# Altium project M.2 Accelerator.PrjPcb (part 1 of 2)
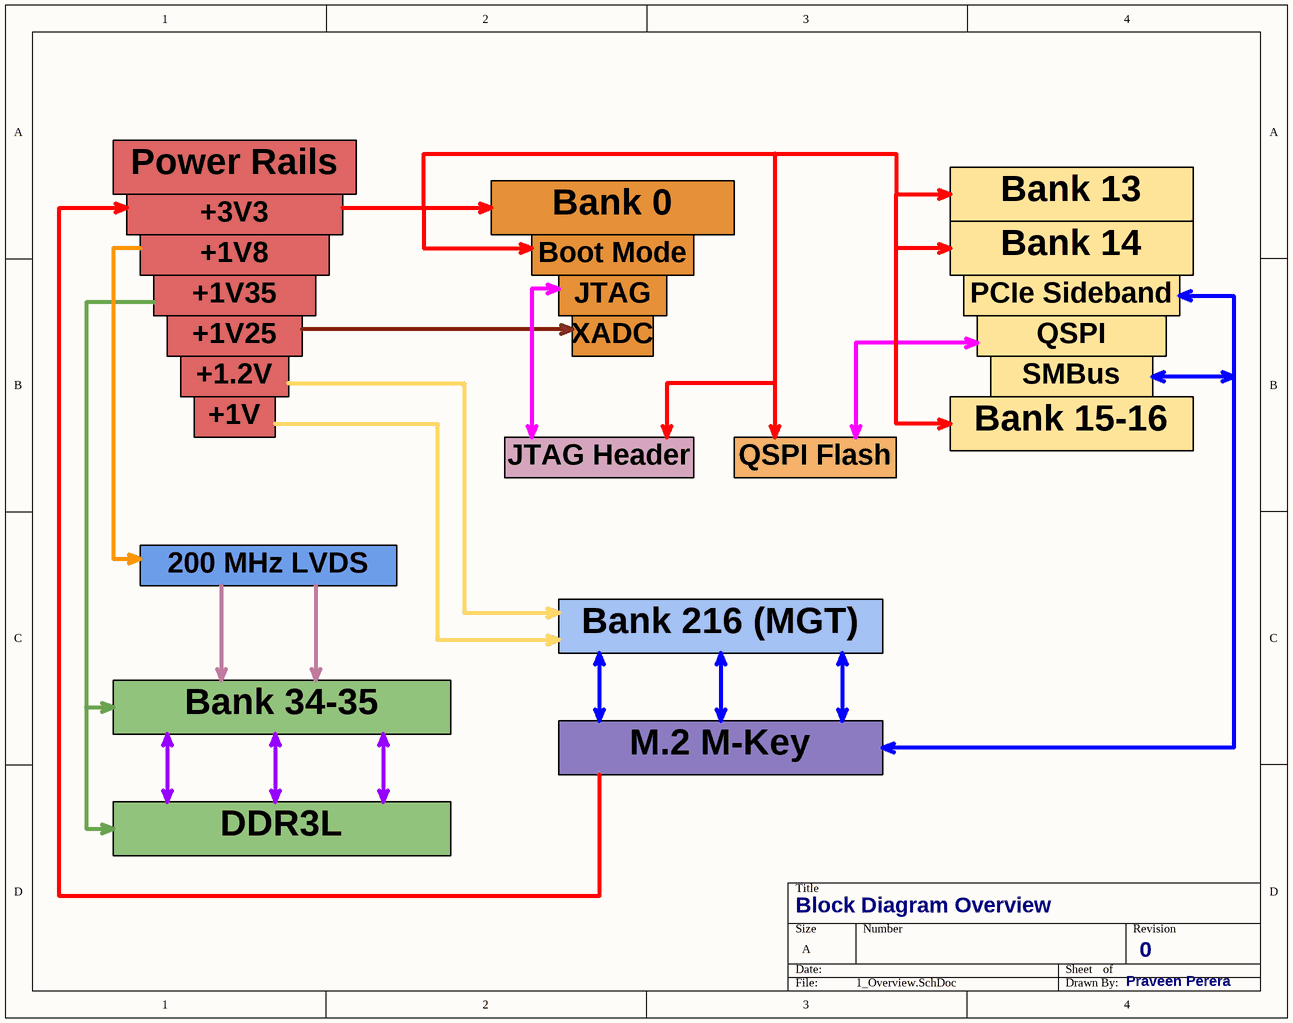
[diagram p0: 1_Overview.SchDoc]
9 sheets, 227 parts. Net scope: global (net labels, ports and power ports of the same name join across sheets).
Sheets:
  1_Overview.SchDoc
  2_PowerRails.SchDoc
  3_PowerDistribution.SchDoc
  4_Configuration.SchDoc
  5_GPIOBanks.SchDoc
  6_DRAMBanks.SchDoc
  7_DDR3L.SchDoc
  8_MGTBank.SchDoc
  9_M.2_B+M.SchDoc

## Sheet 1_Overview.SchDoc: Block Diagram Overview
size A; Date: 12/31/2025; Author: Praveen Perera; DrawnBy: Praveen Perera; Engineer: Praveen Perera; Revision: 0; SheetNumber: 1; SheetTotal: 9

### Notes on the sheet
- Power Rails
- +3V3
- Bank 0
- Bank 13
- +1V8
- Boot Mode
- Bank 14
- +1V35
- +1V25
- JTAG
- XADC
- PCIe Sideband
- QSPI
- +1.2V
- +1V
- SMBus
- JTAG Header
- QSPI Flash
- Bank 15-16
- 200 MHz LVDS CLK
- Bank 216 (MGT)
- Bank 34-35 (DDR3L)
- M.2 M-Key
- DDR3L

## Sheet 2_PowerRails.SchDoc: Power Conversion + Rails
size C; Author: Praveen Perera; DrawnBy: Praveen Perera; Engineer: Praveen Perera; Revision: 1; SheetNumber: 2; SheetTotal: 9; Time: 12/22/2025
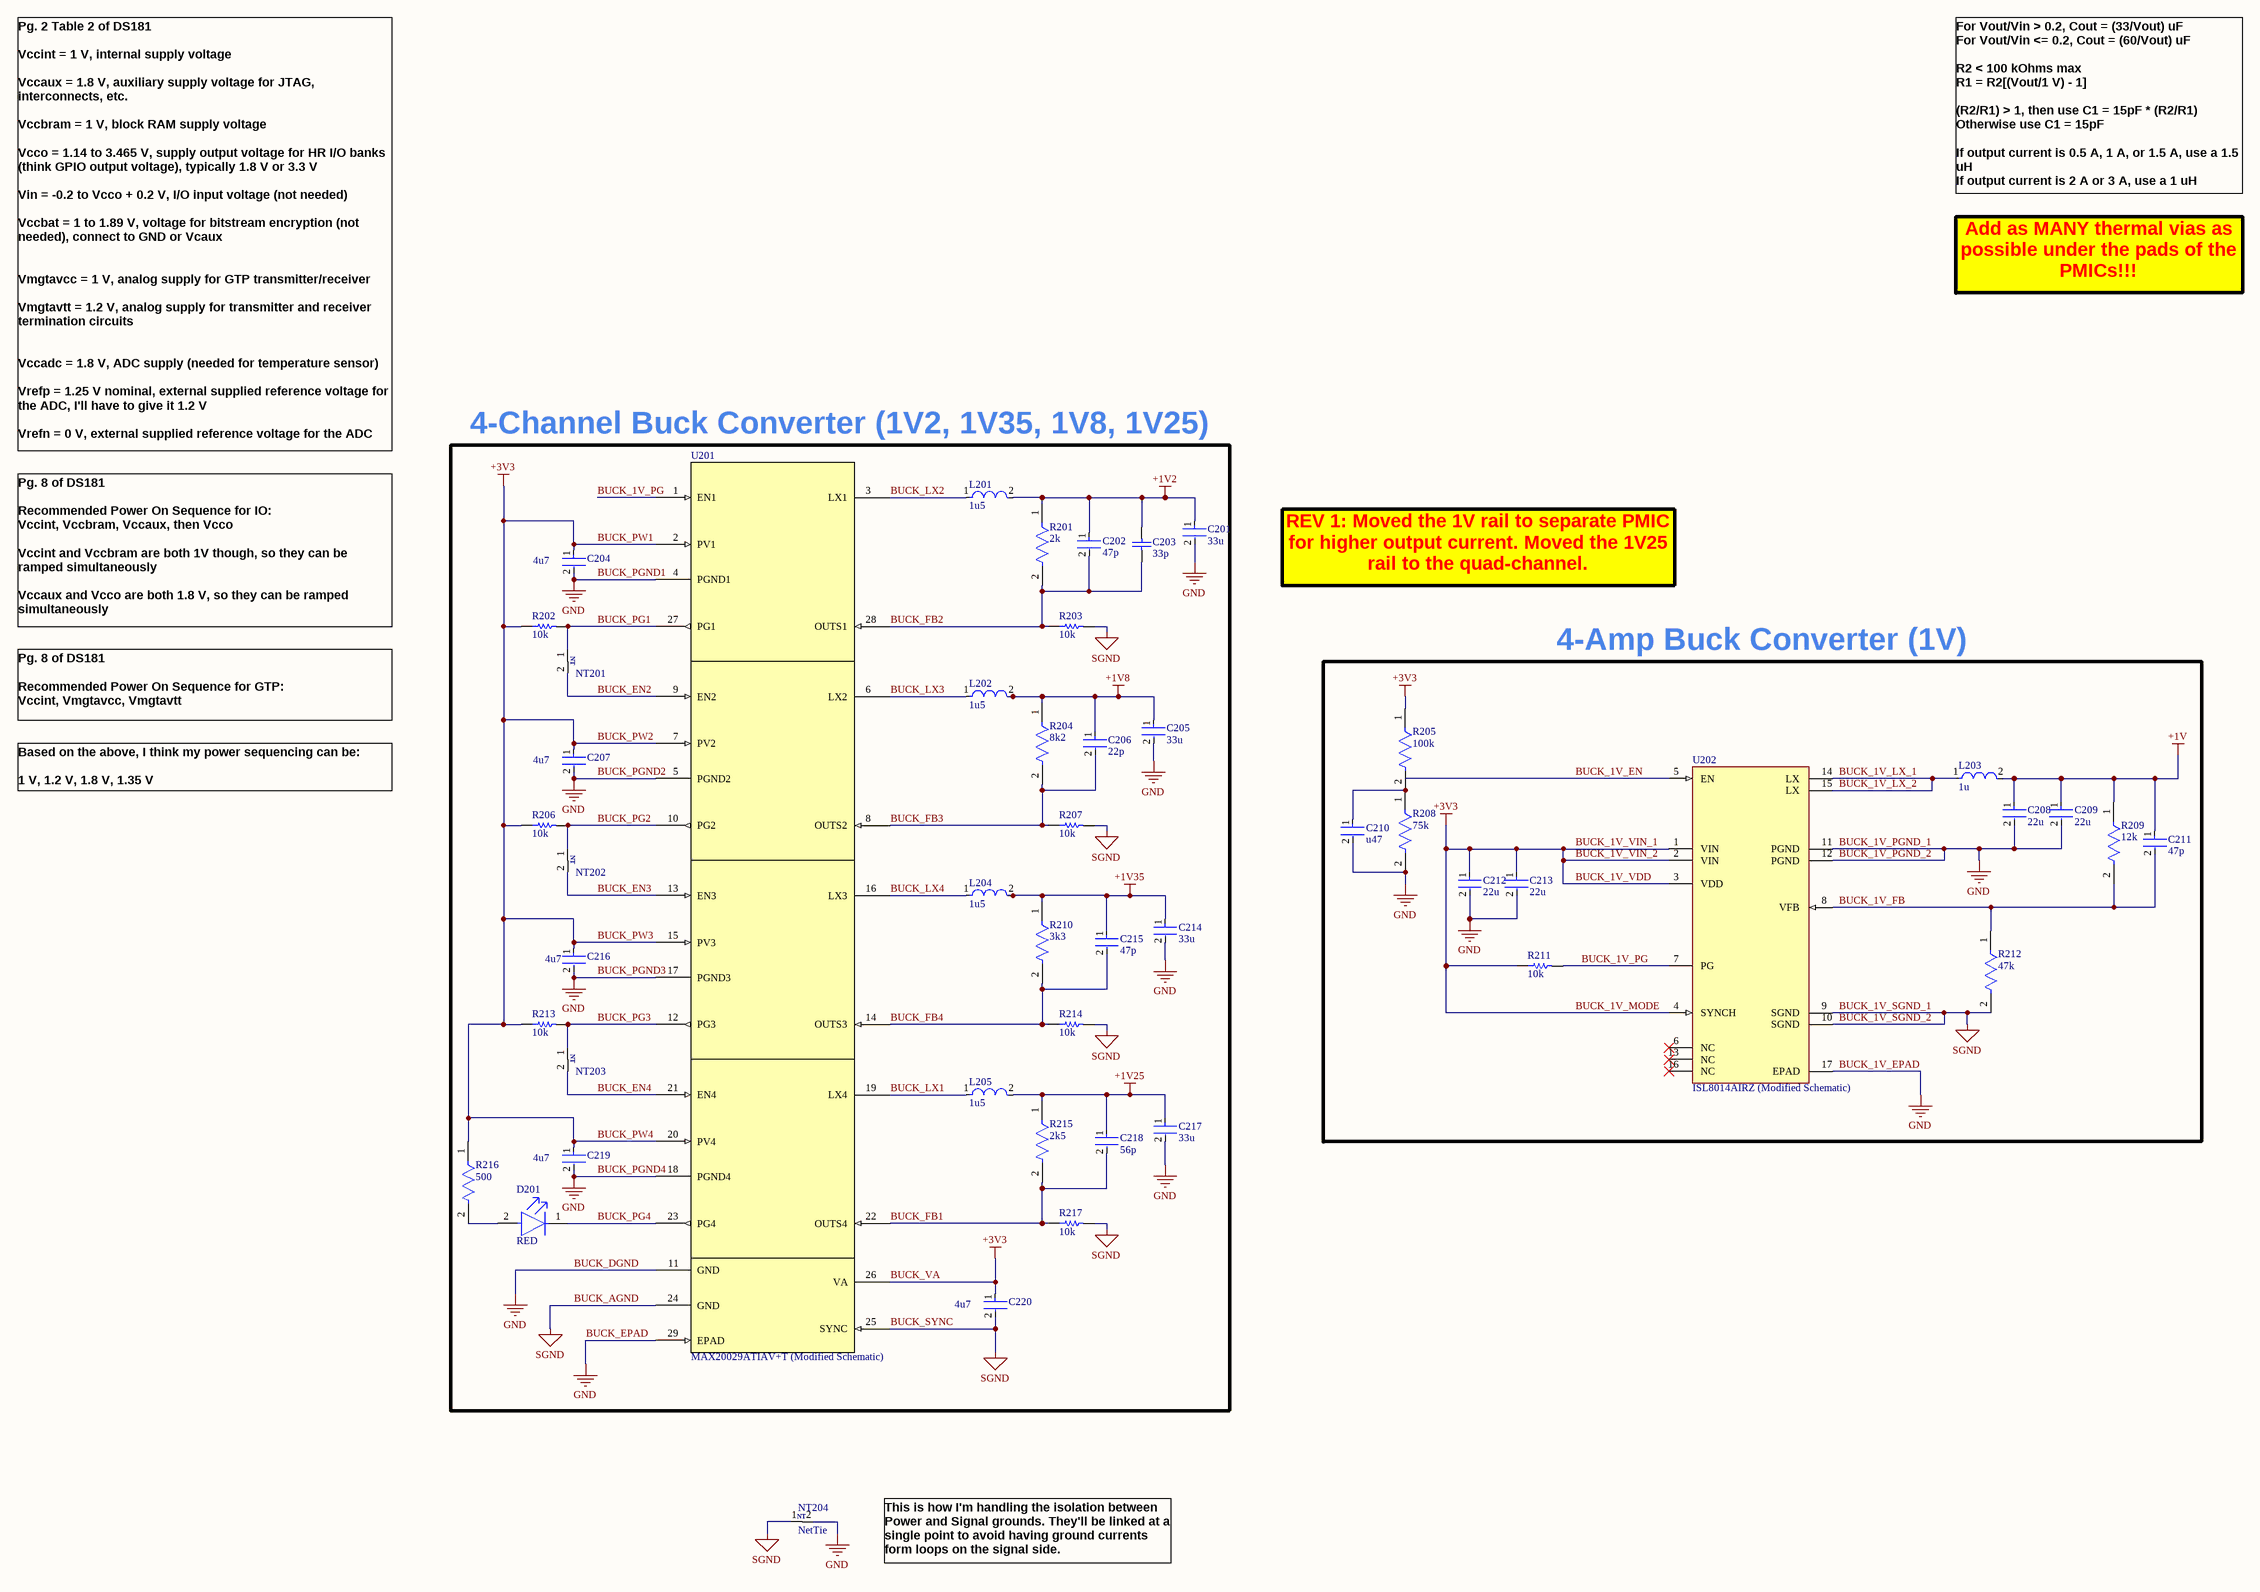
[diagram p1: 2_PowerRails.SchDoc]

### Parts
C201  33u  [FP-C2012-125-0_2-IPC_A]
C202  47p  [FP-GCQ155-0_05-MFG]
C203  33p  [CAPC1005X60X26NL10T16]
C204  4u7  [FP-GCM31C-0_2-e0_3_0_8-IPC_C]
C205  33u  [FP-C2012-125-0_2-IPC_A]
C206  22p  [FP-GJM155-0_05-IPC_A]
C207  4u7  [FP-GCM31C-0_2-e0_3_0_8-IPC_C]
C208  22u  [FP-GRM188-0_2-IPC_A]
C209  22u  [FP-GRM188-0_2-IPC_A]
C210  u47  [FP-C0603-030-0_03-IPC_A]
C211  47p  [FP-GCQ155-0_05-MFG]
C212  22u  [FP-GRM188-0_2-IPC_A]
C213  22u  [FP-GRM188-0_2-IPC_A]
C214  33u  [FP-C2012-125-0_2-IPC_A]
C215  47p  [FP-GCQ155-0_05-MFG]
C216  4u7  [FP-GCM31C-0_2-e0_3_0_8-IPC_C]
C217  33u  [FP-C2012-125-0_2-IPC_A]
C218  56p  [FP-C0402-BB-MFG]
C219  4u7  [FP-GCM31C-0_2-e0_3_0_8-IPC_C]
C220  4u7  [FP-GCM31C-0_2-e0_3_0_8-IPC_C]
D201  RED  [FP-SML-LX0603SIW-TR-MFG]
L201  1u5  [FP-IHLP-2525CZ-FP_2_413x3-MFG]
L202  1u5  [FP-IHLP-2525CZ-FP_2_413x3-MFG]
L203  1u  [FP-IHLP-2525CZ-FP_2_413x3-MFG]
L204  1u5  [FP-IHLP-2525CZ-FP_2_413x3-MFG]
L205  1u5  [FP-IHLP-2525CZ-FP_2_413x3-MFG]
NT201  NetTie  [NETTIE]  (value not drawn)  (net tie, no BOM)
NT202  NetTie  [NETTIE]  (value not drawn)  (net tie, no BOM)
NT203  NetTie  [NETTIE]  (value not drawn)  (net tie, no BOM)
NT204  NetTie  [NETTIE]  (net tie, no BOM)
R201  2k  [FP-MCS0402-IPC_A]
R202  10k  [RESC1005X40X25LL10T10]
R203  10k  [RESC1005X40X25LL10T10]
R204  8k2  [FP-ERA2A-MFG]
R205  100k  [FP-MCS0402-MFG]
R206  10k  [RESC1005X40X25LL10T10]
R207  10k  [RESC1005X40X25LL10T10]
R208  75k  [FP-CR0402-IPC_C]
R209  12k  [FP-RT0402-MFG]
R210  3k3  [FP-ERA2A-MFG]
R211  10k  [RESC1005X40X25LL10T10]
R212  47k  [FP-ERA2A-MFG]
R213  10k  [RESC1005X40X25LL10T10]
R214  10k  [RESC1005X40X25LL10T10]
R215  2k5  [FP-MCT0603-MFG]
R216  500  [FP-PNM0402-MFG]
R217  10k  [RESC1005X40X25LL10T10]
U201  MAX20029ATIAV+T (Modified Schematic)  [21-0140L_T2855-5_MXM]
U202  ISL8014AIRZ (Modified Schematic)  [QFN65P400X400X100-17_L16_4x4_M]

### Nets
+1V: C208.1 C209.1 C211.1 L203.2 R209.1
+1V2: C201.1 C202.1 C203.2 L201.2 R201.1
+1V8: C205.1 C206.1 L202.2 R204.1
+1V25: C217.1 C218.1 L205.2 R215.1
+1V35: C214.1 C215.1 L204.2 R210.1
BUCK_1V_EPAD: C201.2 C204.2 C205.2 C207.2 C208.2 C209.2 C210.2 C212.2 C213.2 C214.2 C216.2 C217.2 C219.2 NT204.2 R208.2 U201.4(PGND1) U201.5(PGND2) U201.11(GND) U201.17(PGND3) U201.18(PGND4) U201.29(EPAD) U202.11(PGND) U202.12(PGND) U202.17(EPAD)  [also labelled BUCK_1V_PGND_1, BUCK_1V_PGND_2, BUCK_DGND, BUCK_EPAD, BUCK_PGND1, BUCK_PGND2, BUCK_PGND3, BUCK_PGND4, GND]
BUCK_1V_MODE: C204.1 C207.1 C212.1 C213.1 C216.1 C219.1 C220.1 R202.1 R205.1 R206.1 R211.1 R213.1 R216.1 U201.2(PV1) U201.7(PV2) U201.15(PV3) U201.20(PV4) U201.26(VA) U202.1(VIN) U202.2(VIN) U202.3(VDD) U202.4(SYNCH)  [also labelled +3V3, BUCK_1V_VDD, BUCK_1V_VIN_1, BUCK_1V_VIN_2, BUCK_PW1, BUCK_PW2, BUCK_PW3, BUCK_PW4, BUCK_VA]
BUCK_1V_SGND_1: C220.2 NT204.1 R203.2 R207.2 R212.2 R214.2 R217.2 U201.24(GND) U201.25(SYNC) U202.9(SGND) U202.10(SGND)  [also labelled BUCK_1V_SGND_2, BUCK_AGND, BUCK_SYNC, SGND]
BUCK_1V_EN: U202.5(EN)
BUCK_1V_FB: C211.2 R209.2 R212.1 U202.8(VFB)
BUCK_1V_LX_1: L203.1 U202.14(LX) U202.15(LX)  [also labelled BUCK_1V_LX_2]
BUCK_1V_PG: R211.2 U201.1(EN1) U202.7(PG)
BUCK_EN2: NT201.2 U201.9(EN2)
BUCK_EN3: NT202.2 U201.13(EN3)
BUCK_EN4: NT203.2 U201.21(EN4)
BUCK_FB1: C218.2 R215.2 R217.1 U201.22(OUTS4)
BUCK_FB2: C202.2 C203.1 R201.2 R203.1 U201.28(OUTS1)
BUCK_FB3: C206.2 R204.2 R207.1 U201.8(OUTS2)
BUCK_FB4: C215.2 R210.2 R214.1 U201.14(OUTS3)
BUCK_LX1: L205.1 U201.19(LX4)
BUCK_LX2: L201.1 U201.3(LX1)
BUCK_LX3: L202.1 U201.6(LX2)
BUCK_LX4: L204.1 U201.16(LX3)
BUCK_PG1: NT201.1 R202.2 U201.27(PG1)
BUCK_PG2: NT202.1 R206.2 U201.10(PG2)
BUCK_PG3: NT203.1 R213.2 U201.12(PG3)
BUCK_PG4: D201.1(C) U201.23(PG4)
NetC210_1: C210.1 R205.2 R208.1
NetD201_2: D201.2(A) R216.2

Not connected (* = marked no-connect by the designer): U202 6(NC)* 13(NC)* 16(NC)*

### Notes on the sheet
- For Vout/Vin > 0.2, Cout = (33/Vout) uF
  For Vout/Vin <= 0.2, Cout = (60/Vout) uF
  R2 < 100 kOhms max
  R1 = R2[(Vout/1 V) - 1]
  (R2/R1) > 1, then use C1 = 15pF * (R2/R1)
  Otherwise use C1 = 15pF
  If output current is 0.5 A, 1 A, or 1.5 A, use a 1.5 uH
  If output current is 2 A or 3 A, use a 1 uH
  If output voltage is less than 0.9 V, use a 0.47 uH
- Add as MANY thermal vias as possible under the pads of the PMICs!!!
- Pg. 2 Table 2 of DS181
  Vccint = 1 V, internal supply voltage
  Vccaux = 1.8 V, auxiliary supply voltage for JTAG, interconnects, etc.
  Vccbram = 1 V, block RAM supply voltage
  Vcco = 1.14 to 3.465 V, supply output voltage for HR I/O banks (think GPIO output voltage), typically 1.8 V or 3.3 V
  Vin = -0.2 to Vcco + 0.2 V, I/O input voltage (not needed)
  Vccbat = 1 to 1.89 V, voltage for bitstream encryption (not needed), connect to GND or Vcaux
  Vmgtavcc = 1 V, analog supply for GTP transmitter/receiver
  Vmgtavtt = 1.2 V, analog supply for transmitter and receiver termination circuits
  Vccadc = 1.8 V, ADC supply (needed for temperature sensor)
  Vrefp = 1.25 V nominal, external supplied reference voltage for the ADC, I'll have to give it 1.2 V
  Vrefn = 0 V, external supplied reference voltage for the ADC
- 4-Channel Buck Converter (1V2, 1V35, 1V8, 1V25)
- Pg. 8 of DS181
  Recommended Power On Sequence for IO:
  Vccint, Vccbram, Vccaux, then Vcco
  Vccint and Vccbram are both 1V though, so they can be ramped simultaneously
  Vccaux and Vcco are both 1.8 V, so they can be ramped simultaneously
- REV 1: Moved the 1V rail to separate PMIC for higher output current. Moved the 1V25 rail to the quad-channel.
- 4-Amp Buck Converter (1V)
- Pg. 8 of DS181
  Recommended Power On Sequence for GTP:
  Vccint, Vmgtavcc, Vmgtavtt
- Based on the above, I think my power sequencing can be:
  1 V, 1.2 V, 1.8 V, 1.35 V
- This is how I'm handling the isolation between Power and Signal grounds. They'll be linked at a single point to avoid having ground currents form loops on the signal side.
- (in symbol CMP-047-000007-1) NT

### Library data of the parts
C201 C205 C214 C217 = CMP-08246-002720-1: C2012X5R1A336M125AC / Multilayer Ceramic Capacitors 33μF ±20% 10V X5R SMD 0805; Capacitance: 33uF; Dielectric: X5R; Series: C; Packaging: Tape and Reel; Voltage Rating: 10V; Height: 1.25mm; Tolerance: 20%; Thickness: 0.057inch; Min Operating Temperature: -55°C; Max Operating Temperature: 85°C; Case Code (Imperial): 0805; Voltage Rating (DC): 10V; Case Code (Metric): 2012; Length: 2mm; REACH SVHC: No SVHC; Depth: 1.25mm; Package Quantity: 1; Dielectric Material: Ceramic; Lead Free: Lead Free; Case/Package: 0805; Termination: SMD/SMT; Resistor Type: Ceramic; RoHS Compliant: Yes; Width: 0.049inch; Weight: 0.000194oz; Mount: Surface Mount
C202 C211 C215 = CMP-06035-040611-1: GCQ1555C1H470GB01D / High Q Ceramic Capacitor for Automotive 47pF ±2% 50VDC C0G 0402 Paper T/R
C203 = CMP-2008-01050-1: VJ0402A330JXAAC; Manufacturer: Vitramon; Part Number: VJ0402A330JXAAC
C204 C207 C216 C219 C220 = CMP-06035-020722-1: GCM31CR71E475KA55K / Ceramic Capacitor for Automotive 4.7uF ±10% 25VDC X7R 1206 Embossed T/R; Voltage Rating: 25V; Case Code (Imperial): 1206; Depth: 1.6mm; Length: 3.2mm; Ratings: AEC-Q200; Capacitance: 4.7uF; Height: 1.6mm; Case/Package: 1206; Packaging: Tape and Reel; Radiation Hardening: No; Dielectric: X7R; Case Code (Metric): 3216; Termination: SMD/SMT; Package Quantity: 6000; Max Operating Temperature: 125°C; Voltage Rating (DC): 25V; Thickness: 0.071inch; Width: 0.063inch; Min Operating Temperature: -55°C; Mount: Surface Mount; Tolerance: 10%
C206 = CMP-06035-061679-1: GJM1555C1H220GB01D / Multi-Layer Ceramic Capacitor 22pF C0G  ±2% 0402 Paper T/R; Voltage Rating (DC): 50V; Length: 1mm; Thickness: 500um; Tolerance: 2%; Capacitance: 22pF; RoHS Compliant: Yes; Dielectric: C0G; Width: 500um
C208 C209 C212 C213 = CMP-06035-063651-1: GRM188R61C226ME01D / Multilayer Ceramic Capacitor 22uF 20% 16V X5R 0603 Paper T/R
C210 = CMP-08246-006895-1: C0603X5R1A474M030BC / Multilayer Ceramic Capacitors 470nF ±20% 10V X5R SMD 0201; Package Quantity: 1; Mount: Surface Mount; RoHS Compliant: Yes; Case/Package: 0201; Case Code (Metric): 0603; Max Operating Temperature: 85°C; Series: C; Min Operating Temperature: -55°C; Length: 0.024inch; Dielectric Material: Ceramic; REACH SVHC: No SVHC; Lead Free: Lead Free; Case Code (Imperial): 0201; Width: 0.012inch; Dielectric: X5R; Capacitance: 470nF; Tolerance: 20%; Thickness: 0.013inch; Voltage Rating: 10V; Packaging: Cut Tape; Voltage Rating (DC): 10V
C218 = CMP-03020-005689-1: C0402C560K5HACTU / C0402 56 pF X8R 10.00% 50 V; Manufacturer: Kemet; Material: Ceramic; Voltage Rating: 50 V; Tolerance: 0.1; Capacitance: 56 pF; Value: 56 pF; Temperature Coefficient: 15%; Device Class L1: Passive Components; Description: C0402 56 pF X8R 10.00% 50 V; Device Class L2: Capacitors; Manufacturer Part Number: C0402C560K5HACTU; Package: C0402-BB; ComponentLink2URL: https://content.kemet.com/datasheets/KEM_C1002_X7R_SMD.pdf; Temperature Range Low: -55°C; Category: Cap; RoHS: TRUE; Height: 0.55mm; Temperature: -55°C to +125°C; Temperature Range High: +125°C; Automotive: No; Octopart: https://octopart.com/c0402c560k5hactu-kemet-88724612; Lead Free: Yes; Device Class L3: Ceramic Capacitors; Ipc Land Pattern Name: CAPC10050X50; ComponentLink2Description: Datasheet; Temperature Characteristic: X8R
D201 = CMP-57192-000009-1: SML-LX0603SIW-TR / LED RED DIFFUSED SMD; Test Current: 20mA; Forward Voltage: 2V; Approvals: UL; Dominant Wavelength: 636nm; Viewing Angle: 140°; Lens Color: White; Luminous Intensity: 60mcd; Power Rating: 50mW; Number of LEDs: 1; Color: Red; Forward Current: 20mA; Moisture Sensitivity Level: 2; Case Code (Imperial): 0603; Lead Free: Lead Free; Lens Transparency: Diffused; Case Code (Metric): 1608; Height: 0.6mm; Max Operating Temperature: 85°C; Width: 0.8mm; Lens Style: Diffused; Illumination Color: Red; Wavelength: 636nm; REACH SVHC: No SVHC; Package Quantity: 1; RoHS Compliant: Yes; Case/Package: 0603; Number of Pins: 2; Packaging: Tape and Reel; Length: 1.6mm; Mount: Surface Mount; Min Operating Temperature: -25°C
L201 L202 L204 L205 = CMP-02424-000713-1: IHLP2525CZER1R5M07 / Commercial Inductors, High Saturation Series, 5 % DCR Tolerance 1.5uH 9A 14.5mΩ 20%; DC Resistance (DCR): 14.5mR; Saturation Current: 18A; Test Frequency: 100kHz; Shielding: Shielded; Lead Free: Lead Free; Tolerance: 20%; Radiation Hardening: No; Series: IHLP-2525CZ-07; Width: 0.255inch; Length: 0.27inch; Depth: 6.72mm; Case/Package: Nonstandard; Height: 3mm; Mount: Surface Mount; Package Quantity: 2000; Current Rating: 9A; Height - Seated (Max): 0.118inch; Packaging: Tape and Reel; Inductance: 1.5uH; Max Operating Temperature: 125°C; Min Operating Temperature: -55°C
L203 = CMP-02424-000664-1: IHLP2525CZER1R0M8A / Automotive Inductors, High Temperature (180 °C) Series 1uH 12A 8.45mΩ 20%; Test Frequency: 100kHz; DC Resistance (DCR): 8.45mR; Self Resonant Frequency: 59.1MHz; Saturation Current: 13A; Shielding: Shielded; Inductance Tolerance: 20%; Width: 6.47mm; Min Operating Temperature: -55°C; Height - Seated (Max): 0.118inch; Ratings: AEC-Q200; Max Operating Temperature: 180°C; RMS Current (Irms): 12A; Package Quantity: 2000; Mount: Surface Mount; Height: 3mm; Termination: SMD/SMT; Case/Package: Nonstandard; Packaging: Tape and Reel; Tolerance: 20%; Current Rating: 12A; Inductance: 1uH; Max DC Current: 12A; Length: 0.27inch
NT201-NT204 = CMP-047-000007-1: Net Tie; Source: Schematic-Lib-PhilsLab.SchLib; Design Item ID: NetTie
R201 = CMP-02407-003721-1: MCS0402MD2001BE100 / RES SMD 1.2K OHM 1% 1/10W 0402; Resistance: 2kR; Temperature Coefficient: 25ppm/°C; Power Rating: 63mW; Voltage Rating: 50V; Tolerance: 0.1%; Lead Free: Lead Free; Max Operating Temperature: 155°C; Case/Package: 0402; Case Code (Metric): 1005; Height: 0.32mm; Composition: Thin Film; Weight: 2.1E-05oz; Width: 0.5mm; Case Code (Imperial): 0402; Packaging: Tape and Reel; Length: 1mm; Min Operating Temperature: -55°C; Contact Plating: Tin
R202 R203 R206 R207 R211 R213 R214 R217 = CMP-2002-04584-1: SG73P1ETTP1002F; Manufacturer: KOA Speer; Part Number: SG73P1ETTP1002F
R204 = CMP-2002-05828-2: ERA-2AEB822X / RES SMD 8.2K OHM 0.1% 1/16W 0402; Manufacturer: Panasonic Electronic Components; Value: 8.2kΩ; Temperature Coefficient: 25ppm/°C; Voltage Rating: 50V; Automotive Grade: Grade 0; Power Rating: 0.063W; Temperature Range Low: -55°C; Lead Free: Yes; Device Class L2: Resistors; Height: 0.4mm; RoHS: TRUE; Mouser Description: Thin Film Resistors - SMD 0402 1/16W 8.2Kohms; Octopart: https://octopart.com/era-2aeb822x-panasonic-43284358; Tolerance: 0.1%; Composition: Thin Film; Package: ERA2A; Resistance: 8.2kΩ; Temperature: -55°C to +155°C; Series: ERA; Manufacturer Part Number: ERA-2AEB822X; ComponentLink2URL: https://industrial.panasonic.com/cdbs/www-data/pdf/RDM0000/AOA0000C307.pdf; Digikey Description: RES SMD 8.2K OHM 0.1% 1/16W 0402; ComponentLink2Description: Datasheet; Category: Res; Footprint Url: https://industrial.panasonic.com/cdbs/www-data/pdf/RDM0000/DMM0000COL17.pdf; Temperature Range High: +155°C; Automotive: Yes; Device Class L1: Passive Components; Device Class L3: Chip SMD Resistors
R205 = CMP-02407-000800-1: MCS04020D1003BE000 / RES SMD 1.2K OHM 1% 1/10W 0402; Temperature Coefficient: 25ppm/°C; Resistance: 100kR; Tolerance: 0.1%; Min Operating Temperature: -55°C; Lead Free: Lead Free; Contact Plating: Tin; Radiation Hardening: No; Max Operating Temperature: 125°C; Composition: Thin Film; Case/Package: 0402
R208 = CMP-2002-05392-2: CR0402-FX-7502GLF / Thick Film Chip Resistors 0402 75kΩ 0.0625W 1% 100ppm/°C; Max Power Dissipation: 63mW; Voltage Rating: 50V; Power Rating: 62.5mW; Resistance: 75kR; Min Operating Temperature: -55°C; Max Operating Temperature: 125°C; Mount: Surface Mount; Radiation Hardening: No; Depth: 0.5mm; Case Code (Imperial): 0402; Length: 1mm; Number of Terminations: 2; Case Code (Metric): 1005; Case/Package: 0402; Package Quantity: 10000; Temperature Coefficient: 100ppm/°C; Contact Plating: Tin; Composition: Thick Film; Thickness: 356um; Termination: SMD/SMT; Tolerance: 1%; Packaging: Tape and Reel; Width: 0.5mm; Height: 0.016inch; Military Standard: Not
R209 = CMP-03412-001954-1: RT0402DRE0712KL / RES SMD 12K OHM 0.5% 1/16W 0402; Manufacturer: Yageo; Power Rating: 0.063W; Description: RT0402 12KΩ 0.063W 50 ppm/°C 0.50%; Tolerance: 0.005; Temperature Coefficient: 50 ppm/°C; Voltage Rating: 50V; Value: 12KΩ; Series: RT; Octopart: https://octopart.com/rt0402dre0712kl-yageo-1393491; Category: Res; Mouser Description: Thin Film Resistors 1/16W 12K ohm .5% 50ppm; Manufacturer Part Number: RT0402DRE0712KL; Device Class L1: Passive Components; Height: 0.35mm; Temperature: -55°C to +155°C; ComponentLink2Description: Datasheet; Temperature Range High: +155°C; Device Class L3: Chip SMD Resistors; Device Class L2: Resistors; Lead Free: Yes; Footprint Url: http://www.yageo.com/exep/pages/download/literatures/PYu-R_Mount_10.pdf; Ipc Land Pattern Name: RESC10050X30; RoHS: TRUE; Package: RT0402; Composition: Thin Film; Digikey Description: RES SMD 12K OHM 0.5% 1/16W 0402; Automotive: No; ComponentLink2URL: http://www.yageo.com/documents/recent/PYu-RT_1-to-0.01_RoHS_L_9.pdf; Temperature Range Low: -55°C; Resistance: 12KΩ
R210 = CMP-2002-05884-2: ERA-2AEB332X; NexarPartId: 9251384; Voltage Rating (DC): 25V; Temperature Coefficient: 25ppm/°C; Tolerance: 0.1%; Resistance: 3.3kΩ; Power Rating: 63mW; Case/Package: 0402; Number of Terminations: 2; Military Standard: Not; Case Code (Imperial): 0402; Length: 1mm; Contact Plating: Tin; Termination: SMD/SMT; Schedule B: 8533210045, 8533210045; Voltage Rating: 25V; Lead Free: Lead Free; Min Operating Temperature: -55°C; REACH SVHC: No SVHC; Max Power Dissipation: 63mW; Weight: 793.786648µg; RoHS: Compliant; Depth: 500µm; Packaging: Cut Tape; Max Operating Temperature: 155°C; Width: 500µm; Case Code (Metric): 1005; Height: 350µm; Composition: Thin Film; Lifecycle Status: Production; Radiation Hardening: No; Number of Pins: 2; Mount: Surface Mount
R212 = CMP-2002-05889-2: ERA-2AEB473X; NexarPartId: 9251373; Voltage Rating: 25V; Tolerance: 0.1%; Resistance: 47kΩ; Power Rating: 63mW; Temperature Coefficient: 25ppm/°C; Radiation Hardening: No; Case Code (Imperial): 0402; Depth: 500µm; Military Standard: Not; Number of Pins: 2; Number of Terminations: 2; Length: 1mm; RoHS: Compliant; Case Code (Metric): 1005; Schedule B: 8533210045, 8533210045; Composition: Thin Film; REACH SVHC: Unknown; Lifecycle Status: Production; Case/Package: 0402; Mount: Surface Mount; Packaging: Tape & Reel; Contact Plating: Tin; Lead Free: Lead Free; Max Power Dissipation: 63mW; Voltage Rating (DC): 25V; Height: 350µm; Width: 508µm; Min Operating Temperature: -55°C; Max Operating Temperature: 155°C
R215 = CMP-02407-001734-1: MCT06030E2501BP100 / RES SMD 100 OHM 1% 1/8W 0603; Tolerance: 0.1%; Resistance: 2.5kR; Temperature Coefficient: 15ppm/°C; Length: 1.55mm; Max Operating Temperature: 125°C; Composition: Thin Film; Radiation Hardening: No; Lead Free: Lead Free; Military Standard: Not; Packaging: Tape and Reel; Depth: 0.85mm; Contact Plating: Tin; Width: 850um; Case/Package: 0603; Min Operating Temperature: -55°C
R216 = CMP-02407-011888-1: PNM0402E5000BST1 / RES SMD 500 OHM 0.1% 1/20W 0402; Temperature Coefficient: 25ppm/°C; Max Power Dissipation: 50mW; Resistance: 500R; Width: 0.022inch; Length: 0.042inch; Tolerance: 0.1%; Lead Free: Lead Free; Height: 0.033inch; Case Code (Metric): 1005; Features: Moisture Resistant; Case Code (Imperial): 0402; Max Operating Temperature: 155°C; Case/Package: 0402; Min Operating Temperature: -55°C; Package Quantity: 1000; RoHS Compliant: Yes; Packaging: Tape and Reel; Resistor Type: Thin Film; Number of Terminations: 2
U201 = CMP-010-000006-2: Automotive Quad/Triple Low-Voltage Step-Down DC-DC Converters; Manufacturer_Name: Analog Devices / Maxim Integrated; Manufacturer_Part_Number: MAX20029ATIA/V+T; Source: MAX20029ATIAV&plus_T - Modified.SchLib; RefDes: RefDes; Design Item ID: MAX20029ATIAV+T; Copyright: Copyright (C) 2025 Ultra Librarian. All rights reserved.; Pin Count: 29; Component Type: Standard; Type: Type
U202 = CMP-002-000041-4: ISL8014 Series 2.8 - 5.5 V 1 MHz 4 A Buck Regulator - QFN-16

## Sheet 3_PowerDistribution.SchDoc: FPGA Power Distribution
size A3; Date: 12/24/2025; Author: Praveen Perera; DrawnBy: Praveen Perera; Engineer: Praveen Perera; Revision: 1; SheetNumber: 3; SheetTotal: 9
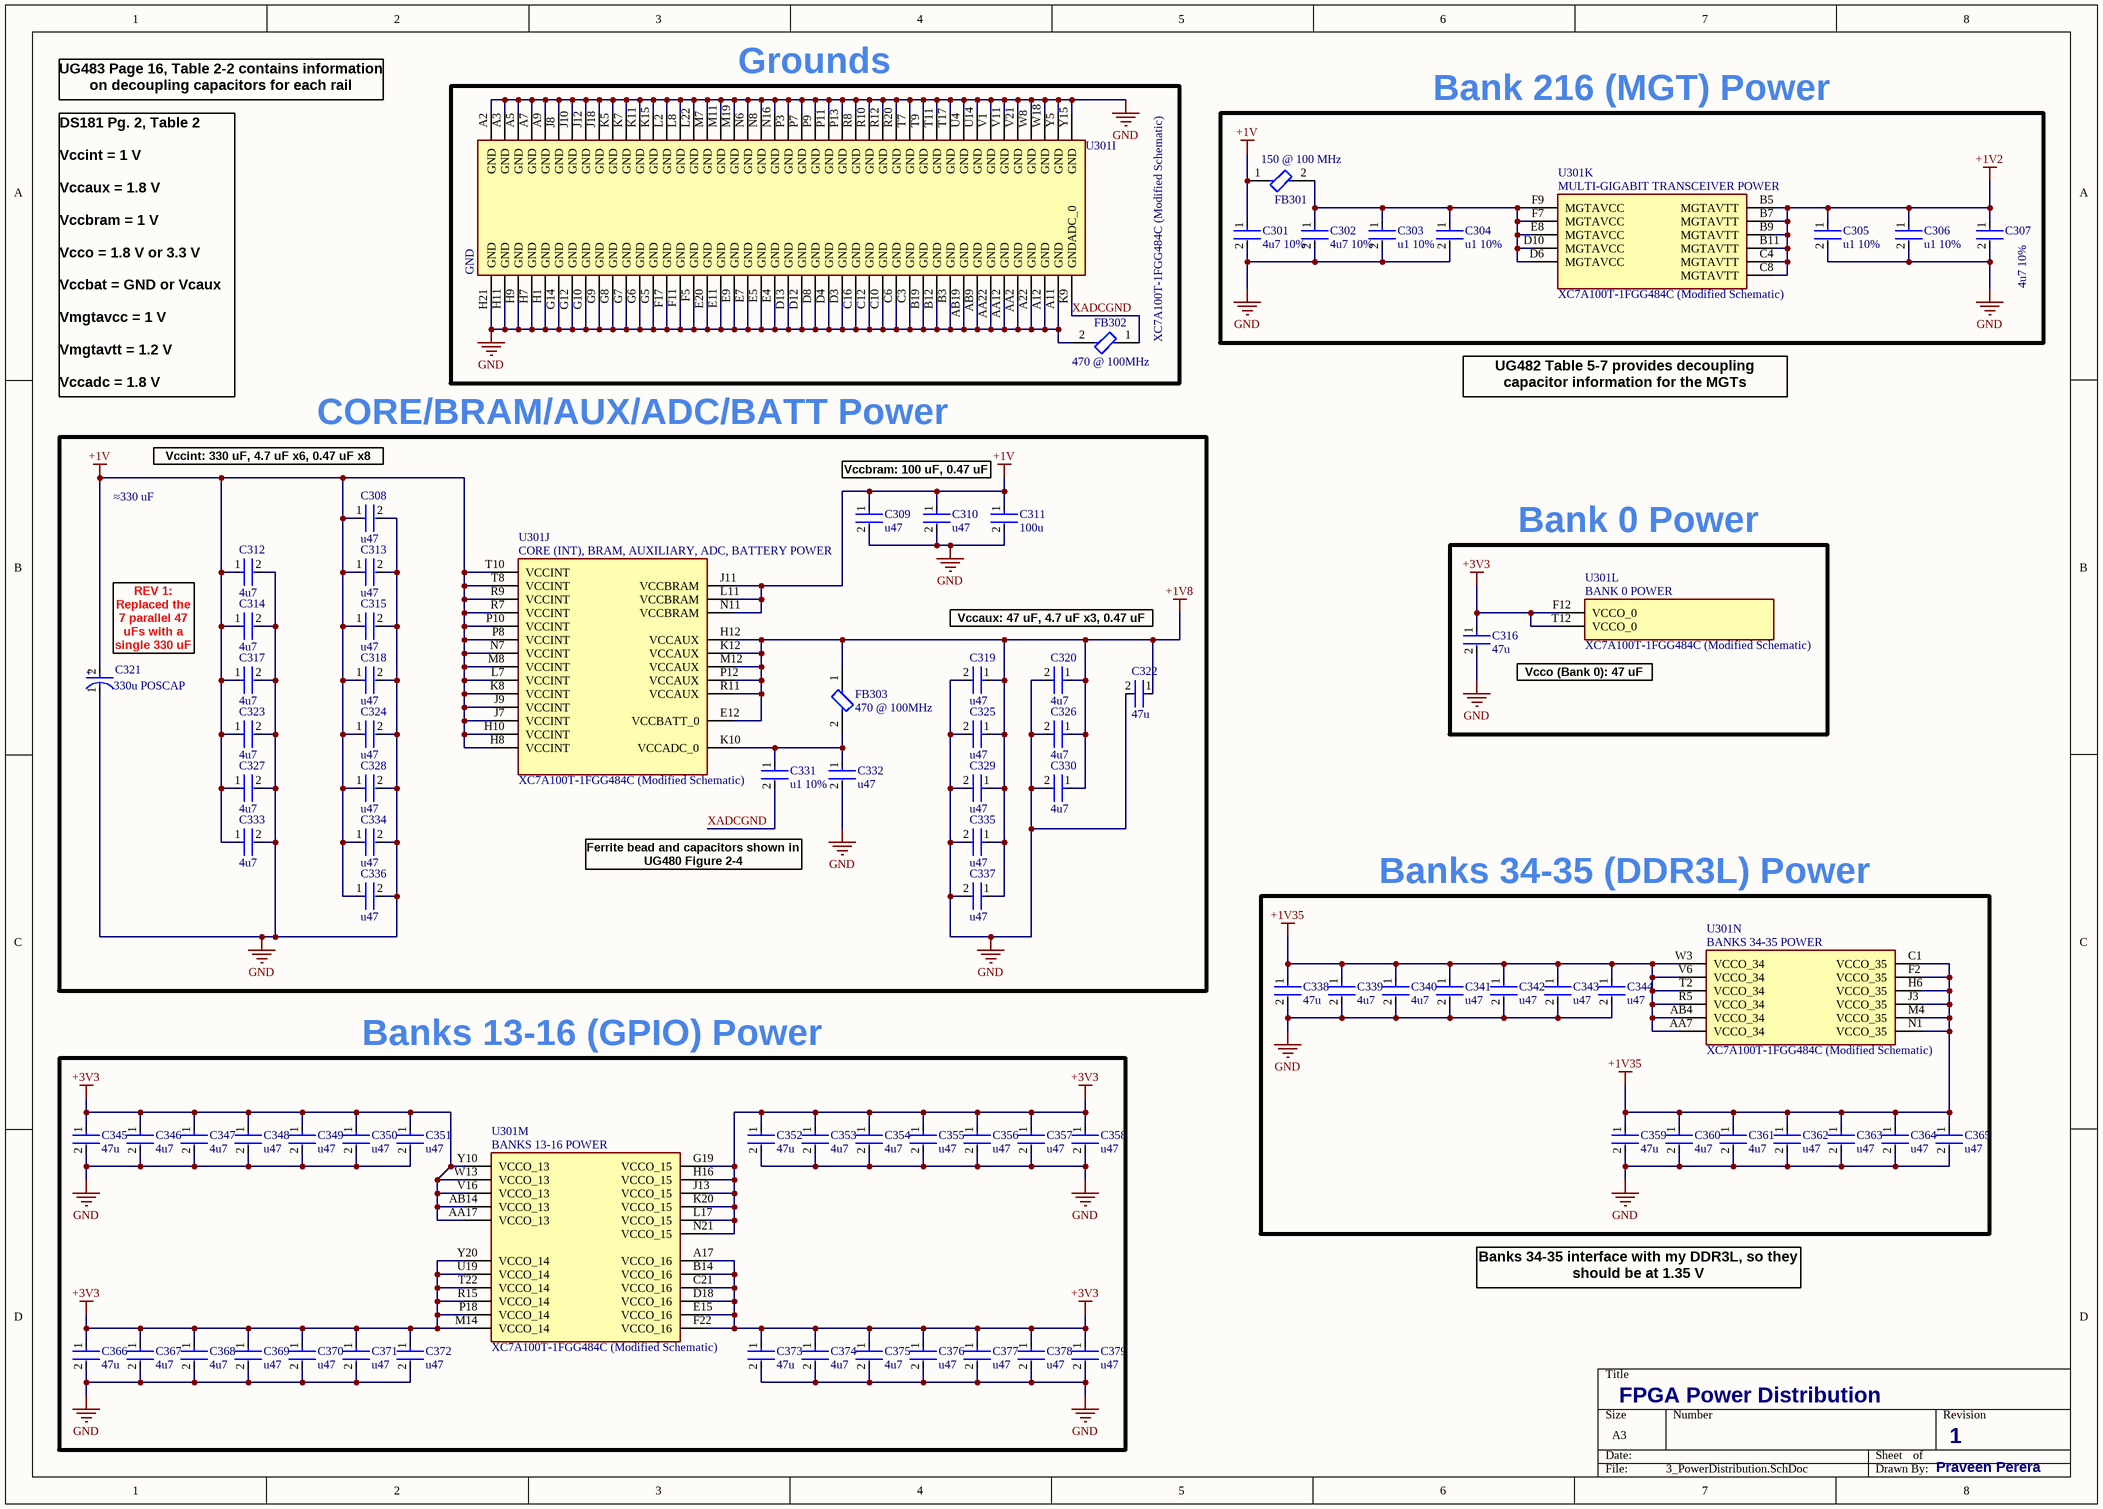
[diagram p2: 3_PowerDistribution.SchDoc]

### Parts
C301  4u7 10%  [FP-C1005-050-0_20-0_10-MFG]
C302  4u7 10%  [FP-C1005-050-0_20-0_10-MFG]
C303  u1 10%  [FP-CL891-IPC_C]
C304  u1 10%  [FP-CL891-IPC_C]
C305  u1 10%  [FP-CL891-IPC_C]
C306  u1 10%  [FP-CL891-IPC_C]
C307  4u7 10%  [FP-C1005-050-0_20-0_10-MFG]
C308  u47  [FP-C0603-030-0_03-IPC_A]
C309  u47  [FP-C0603-030-0_03-IPC_A]
C310  u47  [FP-C0603-030-0_03-IPC_A]
C311  100u  [FP-GRM21B-0_2-e0_2_0_7-IPC_A]
C312  4u7  [FP-CL829-IPC_C]
C313  u47  [FP-C0603-030-0_03-IPC_A]
C314  4u7  [FP-CL829-IPC_C]
C315  u47  [FP-C0603-030-0_03-IPC_A]
C316  47u  [FP-GRM188-0_2-IPC_B]
C317  4u7  [FP-CL829-IPC_C]
C318  u47  [FP-C0603-030-0_03-IPC_A]
C319  u47  [FP-C0603-030-0_03-IPC_A]
C320  4u7  [FP-CL829-IPC_C]
C321  330u POSCAP  [FP-POSCAP-D4-MFG]
C322  47u  [FP-GRM188-0_2-IPC_B]
C323  4u7  [FP-CL829-IPC_C]
C324  u47  [FP-C0603-030-0_03-IPC_A]
C325  u47  [FP-C0603-030-0_03-IPC_A]
C326  4u7  [FP-CL829-IPC_C]
C327  4u7  [FP-CL829-IPC_C]
C328  u47  [FP-C0603-030-0_03-IPC_A]
C329  u47  [FP-C0603-030-0_03-IPC_A]
C330  4u7  [FP-CL829-IPC_C]
C331  u1 10%  [FP-CL891-IPC_C]
C332  u47  [FP-C0603-030-0_03-IPC_A]
C333  4u7  [FP-CL829-IPC_C]
C334  u47  [FP-C0603-030-0_03-IPC_A]
C335  u47  [FP-C0603-030-0_03-IPC_A]
C336  u47  [FP-C0603-030-0_03-IPC_A]
C337  u47  [FP-C0603-030-0_03-IPC_A]
C338  47u  [FP-GRM188-0_2-IPC_B]
C339  4u7  [FP-CL829-IPC_C]
C340  4u7  [FP-CL829-IPC_C]
C341  u47  [FP-C0603-030-0_03-IPC_A]
C342  u47  [FP-C0603-030-0_03-IPC_A]
C343  u47  [FP-C0603-030-0_03-IPC_A]
C344  u47  [FP-C0603-030-0_03-IPC_A]
C345  47u  [FP-GRM188-0_2-IPC_B]
C346  4u7  [FP-CL829-IPC_C]
C347  4u7  [FP-CL829-IPC_C]
C348  u47  [FP-C0603-030-0_03-IPC_A]
C349  u47  [FP-C0603-030-0_03-IPC_A]
C350  u47  [FP-C0603-030-0_03-IPC_A]
C351  u47  [FP-C0603-030-0_03-IPC_A]
C352  47u  [FP-GRM188-0_2-IPC_B]
C353  4u7  [FP-CL829-IPC_C]
C354  4u7  [FP-CL829-IPC_C]
C355  u47  [FP-C0603-030-0_03-IPC_A]
C356  u47  [FP-C0603-030-0_03-IPC_A]
C357  u47  [FP-C0603-030-0_03-IPC_A]
C358  u47  [FP-C0603-030-0_03-IPC_A]
C359  47u  [FP-GRM188-0_2-IPC_B]
C360  4u7  [FP-CL829-IPC_C]
C361  4u7  [FP-CL829-IPC_C]
C362  u47  [FP-C0603-030-0_03-IPC_A]
C363  u47  [FP-C0603-030-0_03-IPC_A]
C364  u47  [FP-C0603-030-0_03-IPC_A]
C365  u47  [FP-C0603-030-0_03-IPC_A]
C366  47u  [FP-GRM188-0_2-IPC_B]
C367  4u7  [FP-CL829-IPC_C]
C368  4u7  [FP-CL829-IPC_C]
C369  u47  [FP-C0603-030-0_03-IPC_A]
C370  u47  [FP-C0603-030-0_03-IPC_A]
C371  u47  [FP-C0603-030-0_03-IPC_A]
C372  u47  [FP-C0603-030-0_03-IPC_A]
C373  47u  [FP-GRM188-0_2-IPC_B]
C374  4u7  [FP-CL829-IPC_C]
C375  4u7  [FP-CL829-IPC_C]
C376  u47  [FP-C0603-030-0_03-IPC_A]
C377  u47  [FP-C0603-030-0_03-IPC_A]
C378  u47  [FP-C0603-030-0_03-IPC_A]
C379  u47  [FP-C0603-030-0_03-IPC_A]
FB301  150 @ 100 MHz  [FP-MPZ1005-IPC_B]
FB302  470 @ 100MHz  [FP-BLM41-0_2-a1_2-IPC_B]
FB303  470 @ 100MHz  [FP-BLM41-0_2-a1_2-IPC_B]
U301  XC7A100T-1FGG484C (Modified Schematic)  [BGA484C100P22X22_2300X2300X260N]  (parts I,J,K,L,M,N of 14)

### Blocks framed on the sheet
≈330 uF: C308-C315 C317-C337 FB303 U301

### Nets
+1V: C301.1 C308.1 C309.1 C310.1 C311.1 C312.1 C313.1 C314.1 C315.1 C317.1 C318.1 C321.2(A) C323.1 C324.1 C327.1 C328.1 C333.1 C334.1 C336.1 FB301.1 U301.H8(VCCINT) U301.H10(VCCINT) U301.J7(VCCINT) U301.J9(VCCINT) U301.J11(VCCBRAM) U301.K8(VCCINT) U301.L7(VCCINT) U301.L11(VCCBRAM) U301.M8(VCCINT) U301.N7(VCCINT) U301.N11(VCCBRAM) U301.P8(VCCINT) U301.P10(VCCINT) U301.R7(VCCINT) U301.R9(VCCINT) U301.T8(VCCINT) U301.T10(VCCINT)
+1V2: C305.1 C306.1 C307.1 U301.B5(MGTAVTT) U301.B7(MGTAVTT) U301.B9(MGTAVTT) U301.B11(MGTAVTT) U301.C4(MGTAVTT) U301.C8(MGTAVTT)
+1V8: C319.1 C320.1 C322.1 C325.1 C326.1 C329.1 C330.1 C335.1 C337.1 FB303.1 U301.E12(VCCBATT_0) U301.H12(VCCAUX) U301.K12(VCCAUX) U301.M12(VCCAUX) U301.P12(VCCAUX) U301.R11(VCCAUX)
+1V35: C338.1 C339.1 C340.1 C341.1 C342.1 C343.1 C344.1 C359.1 C360.1 C361.1 C362.1 C363.1 C364.1 C365.1 U301.AA7(VCCO_34) U301.AB4(VCCO_34) U301.C1(VCCO_35) U301.F2(VCCO_35) U301.H6(VCCO_35) U301.J3(VCCO_35) U301.M4(VCCO_35) U301.N1(VCCO_35) U301.R5(VCCO_34) U301.T2(VCCO_34) U301.V6(VCCO_34) U301.W3(VCCO_34)
+3V3: C316.1 C345.1 C346.1 C347.1 C348.1 C349.1 C350.1 C351.1 C352.1 C353.1 C354.1 C355.1 C356.1 C357.1 C358.1 C366.1 C367.1 C368.1 C369.1 C370.1 C371.1 C372.1 C373.1 C374.1 C375.1 C376.1 C377.1 C378.1 C379.1 U301.A17(VCCO_16) U301.AA17(VCCO_13) U301.AB14(VCCO_13) U301.B14(VCCO_16) U301.C21(VCCO_16) U301.D18(VCCO_16) U301.E15(VCCO_16) U301.F12(VCCO_0) U301.F22(VCCO_16) U301.G19(VCCO_15) U301.H16(VCCO_15) U301.J13(VCCO_15) U301.K20(VCCO_15) U301.L17(VCCO_15) U301.M14(VCCO_14) U301.N21(VCCO_15) U301.P18(VCCO_14) U301.R15(VCCO_14) U301.T12(VCCO_0) U301.T22(VCCO_14) U301.U19(VCCO_14) U301.V16(VCCO_13) U301.W13(VCCO_13) U301.Y10(VCCO_13) U301.Y20(VCCO_14)  [project net BUCK_1V_MODE]
GND: C301.2 C302.2 C303.2 C304.2 C305.2 C306.2 C307.2 C308.2 C309.2 C310.2 C311.2 C312.2 C313.2 C314.2 C315.2 C316.2 C317.2 C318.2 C319.2 C320.2 C321.1(C) C322.2 C323.2 C324.2 C325.2 C326.2 C327.2 C328.2 C329.2 C330.2 C332.2 C333.2 C334.2 C335.2 C336.2 C337.2 C338.2 C339.2 C340.2 C341.2 C342.2 C343.2 C344.2 C345.2 C346.2 C347.2 C348.2 C349.2 C350.2 C351.2 C352.2 C353.2 C354.2 C355.2 C356.2 C357.2 C358.2 C359.2 C360.2 C361.2 C362.2 C363.2 C364.2 C365.2 C366.2 C367.2 C368.2 C369.2 C370.2 C371.2 C372.2 C373.2 C374.2 C375.2 C376.2 C377.2 C378.2 C379.2 FB302.2 U301.A2(GND) U301.A3(GND) U301.A5(GND) U301.A7(GND) U301.A9(GND) U301.A11(GND) U301.A12(GND) U301.A22(GND) U301.AA2(GND) U301.AA12(GND) U301.AA22(GND) U301.AB9(GND) U301.AB19(GND) U301.B3(GND) U301.B12(GND) U301.B19(GND) U301.C3(GND) U301.C6(GND) U301.C10(GND) U301.C12(GND) U301.C16(GND) U301.D3(GND) U301.D4(GND) U301.D8(GND) U301.D12(GND) U301.D13(GND) U301.E4(GND) U301.E5(GND) U301.E7(GND) U301.E9(GND) U301.E11(GND) U301.E20(GND) U301.F5(GND) U301.F11(GND) U301.F17(GND) U301.G5(GND) U301.G6(GND) U301.G7(GND) U301.G8(GND) U301.G9(GND) U301.G10(GND) U301.G12(GND) U301.G14(GND) U301.H1(GND) U301.H7(GND) U301.H9(GND) U301.H11(GND) U301.H21(GND) U301.J8(GND) U301.J10(GND) U301.J12(GND) U301.J18(GND) U301.K5(GND) U301.K7(GND) U301.K11(GND) U301.K15(GND) U301.L2(GND) U301.L8(GND) U301.L22(GND) U301.M7(GND) U301.M11(GND) U301.M19(GND) U301.N6(GND) U301.N8(GND) U301.N16(GND) U301.P3(GND) U301.P7(GND) U301.P9(GND) U301.P11(GND) U301.P13(GND) U301.R8(GND) U301.R10(GND) U301.R12(GND) U301.R20(GND) U301.T7(GND) U301.T9(GND) U301.T11(GND) U301.T17(GND) U301.U4(GND) U301.U14(GND) U301.V1(GND) U301.V11(GND) U301.V21(GND) U301.W8(GND) U301.W18(GND) U301.Y5(GND) U301.Y15(GND)  [project net BUCK_1V_EPAD]
XADCGND: C331.2 FB302.1 U301.K9(GNDADC_0)
NetC302_1: C302.1 C303.1 C304.1 FB301.2 U301.D6(MGTAVCC) U301.D10(MGTAVCC) U301.E8(MGTAVCC) U301.F7(MGTAVCC) U301.F9(MGTAVCC)
NetC331_1: C331.1 C332.1 FB303.2 U301.K10(VCCADC_0)

### Notes on the sheet
- UG483 Page 16, Table 2-2 contains information on decoupling capacitors for each rail
- Grounds
- Bank 216 (MGT) Power
- DS181 Pg. 2, Table 2
  Vccint = 1 V
  Vccaux = 1.8 V
  Vccbram = 1 V
  Vcco = 1.8 V or 3.3 V
  Vccbat = GND or Vcaux
  Vmgtavcc = 1 V
  Vmgtavtt = 1.2 V
  Vccadc = 1.8 V
- (near FB302) CORE/BRAM/AUX/ADC/BATT Power
- UG482 Table 5-7 provides decoupling capacitor information for the MGTs
- Vccint: 330 uF, 4.7 uF x6, 0.47 uF x8
- Vccbram: 100 uF, 0.47 uF x2
- Bank 0 Power
- (near C321) REV 1: Replaced the 7 parallel 47 uFs with a single 330 uF
- Vccaux: 47 uF, 4.7 uF x3, 0.47 uF x5
- Vcco (Bank 0): 47 uF
- Ferrite bead and capacitors shown in UG480 Figure 2-4
- Banks 34-35 (DDR3L) Power
- Banks 13-16 (GPIO) Power
- Banks 34-35 interface with my DDR3L, so they should be at 1.35 V
- (in symbol CMP-05428-001073-1) +
- (in symbol XC7A100T-1FGG484C, part J) CORE (INT), BRAM, AUXILIARY, ADC, BATTERY POWER
- (in symbol XC7A100T-1FGG484C, part K) MULTI-GIGABIT TRANSCEIVER POWER
- (in symbol XC7A100T-1FGG484C, part L) BANK 0 POWER
- (in symbol XC7A100T-1FGG484C, part M) BANKS 13-16 POWER
- (in symbol XC7A100T-1FGG484C, part N) BANKS 34-35 POWER

### Library data of the parts
C301 C302 C307 = CMP-08246-007228-1: C1005X5R1A475K050BE / CAP CER 4.7UF 10V X5R 0402; Max Operating Temperature: 85°C; Case Code (Metric): 1005; Voltage Rating: 10V; Tolerance: 10%; Packaging: Tape and Reel; Capacitance: 4.7uF; Case/Package: 0402; Features: Soft Termination; Min Operating Temperature: -55°C; Mount: Surface Mount; Case Code (Imperial): 0402; RoHS Compliant: Yes
C303-C306 C331 = CMP-13271-001945-1: CL05B104KB5NNNC / Cap Ceramic 100nF 50V X7R ±10% SMD 0402 +125°C Paper T/R
C308-C310 C313 C315 C318 C319 C324 C325 C328 C329 C332 C334-C337 C341-C344 C348-C351 C355-C358 C362-C365 C369-C372 C376-C379 = CMP-08246-006895-1: as C210 on sheet 2_PowerRails; Package Quantity: 1; Mount: Surface Mount; RoHS Compliant: Yes; Case/Package: 0201; Case Code (Metric): 0603; Max Operating Temperature: 85°C; Series: C; Min Operating Temperature: -55°C; Length: 0.024inch; Dielectric Material: Ceramic; REACH SVHC: No SVHC; Lead Free: Lead Free; Case Code (Imperial): 0201; Width: 0.012inch; Dielectric: X5R; Capacitance: 470nF; Tolerance: 20%; Thickness: 0.013inch; Voltage Rating: 10V; Packaging: Cut Tape; Voltage Rating (DC): 10V
C311 = CMP-2000-07599-2: GRM21BR60J107ME15L / Chip Multilayer Ceramic Capacitors for General Purpose, 0805, 100uF, X5R, 15%, 20%, 6.3V; Length: 0.079inch; Dielectric: X5R; Case Code (Metric): 2012; Max Operating Temperature: 85°C; Voltage Rating (DC): 6.3V; Min Operating Temperature: -55°C; Tolerance: 20%; Packaging: Cut Tape; Voltage Rating: 6.3V; Capacitance: 100uF; REACH SVHC: No SVHC; Width: 0.049inch; Mount: Surface Mount; Case/Package: 0805; Case Code (Imperial): 0805; Lead Free: Lead Free; Thickness: 0.057inch
C312 C314 C317 C320 C323 C326 C327 C330 C333 C339 C340 C346 C347 C353 C354 C360 C361 C367 C368 C374 C375 = CMP-13271-001468-1: CL05A475MO5NUNC / Cap Ceramic 4.7uF 16V X5R ±20% SMD 0402 +85°C Paper T/R; Mount: Surface Mount; Case Code (Metric): 1005; Case/Package: 0402; Length: 0.039inch; Capacitance: 4.7uF; Voltage Rating: 16V; Max Operating Temperature: 85°C; Tolerance: 20%; Thickness: 0.022inch; Min Operating Temperature: -55°C; Case Code (Imperial): 0402; Packaging: Tape and Reel; Width: 0.02inch
C316 C322 C338 C345 C352 C359 C366 C373 = CMP-2000-05444-2: GRM188R60J476ME15D / Chip Multilayer Ceramic Capacitors for General Purpose, 0603, 47uF, X5R, 15%, 20%, 6.3V; Voltage Rating (DC): 6.3V; Thickness: 0.039inch; Case Code (Imperial): 0603; Packaging: Tape and Reel; Capacitance: 47uF; Width: 0.031inch; Dielectric: X5R; Max Operating Temperature: 85°C; Mount: Surface Mount; Case Code (Metric): 1608; Length: 0.063inch; Voltage Rating: 6.3V; Tolerance: 20%; Case/Package: 0603; Min Operating Temperature: -55°C
C321 = CMP-05428-001073-1: 10TCE330M / CAP TANT POLY 330UF 10V 2917; Tolerance: 20%; ESR (Equivalent Series Resistance): 25mR; Life (Hours): 1000Hour; Packaging: Cut Tape; Case Code (Metric): 7343; Min Operating Temperature: -55°C; Capacitance: 330uF; Max Operating Temperature: 125°C; Case Code (Imperial): 2917; RoHS Compliant: Yes; Series: POSCAP® TC; Width: 0.169inch; Height - Seated (Max): 0.157inch; Case/Package: 2917; Mount: Surface Mount; Features: General Purpose; Voltage Rating (DC): 10V; Length: 0.287inch; Voltage Rating: 10V
FB301 = CMP-08257-000209-1: MPZ1005A151ETD25 / Power line Ferrite Bead 150Ω @ 100MHz 0.8A DCR 0.18Ω AEC-Q200 SMD 0402; RoHS Compliant: Yes
FB302 FB303 = CMP-0686-00760-3: BLM41PG471SN1L / Ferrite Bead, 1806, 470Ω @ 100MHz, 25%, 0.05Ω, 2A; Material: Steel; Number of Circuits: 1; Shielding: Unshielded; DC Resistance (DCR): 50mR; Impedance: 470R; Min Operating Temperature: -55°C; Case/Package: 1806; Packaging: Tape and Reel; DC Current: 2A; Frequency: 100MHz; Length: 4.5mm; Max Operating Temperature: 125°C; Package Quantity: 1; Max Current Rating: 2A; Radiation Hardening: No; RoHS Compliant: Yes; Lead Free: Lead Free; Height: 1.6mm; Test Frequency: 100MHz; Series: BLM41P; Width: 1.6mm; Core Material: Ferrite; Case Code (Imperial): 1806; Termination: SMD/SMT; Tolerance: 25%; Number of Pins: 2; Number of Lines: 1; Case Code (Metric): 4516; Current Rating: 2A; Max DC Current: 2A; DC Resistance-Max: 50mR; Depth: 1.6mm; Military Standard: Not
U301 = XC7A100T-1FGG484C: Artix-7 Field Programmable Gate Array (FPGA) IC 285 4976640 101440 484-BBGA; MF: Xilinx Inc.; Check_prices: https://www.snapeda.com/parts/XC7A100T-1FGG484C/Xilinx/view-part/?ref=eda; MP: XC7A100T-1FGG484C; Package: FBGA-484 Xilinx; SnapEDA_Link: https://www.snapeda.com/parts/XC7A100T-1FGG484C/Xilinx/view-part/?ref=snap; Value: *

## Sheet 4_Configuration.SchDoc: FPGA Configuration
size Legal; Author: Praveen Perera; DrawnBy: Praveen Perera; Engineer: Praveen Perera; Revision: 0; SheetNumber: 4; SheetTotal: 9; Time: 12/26/2025
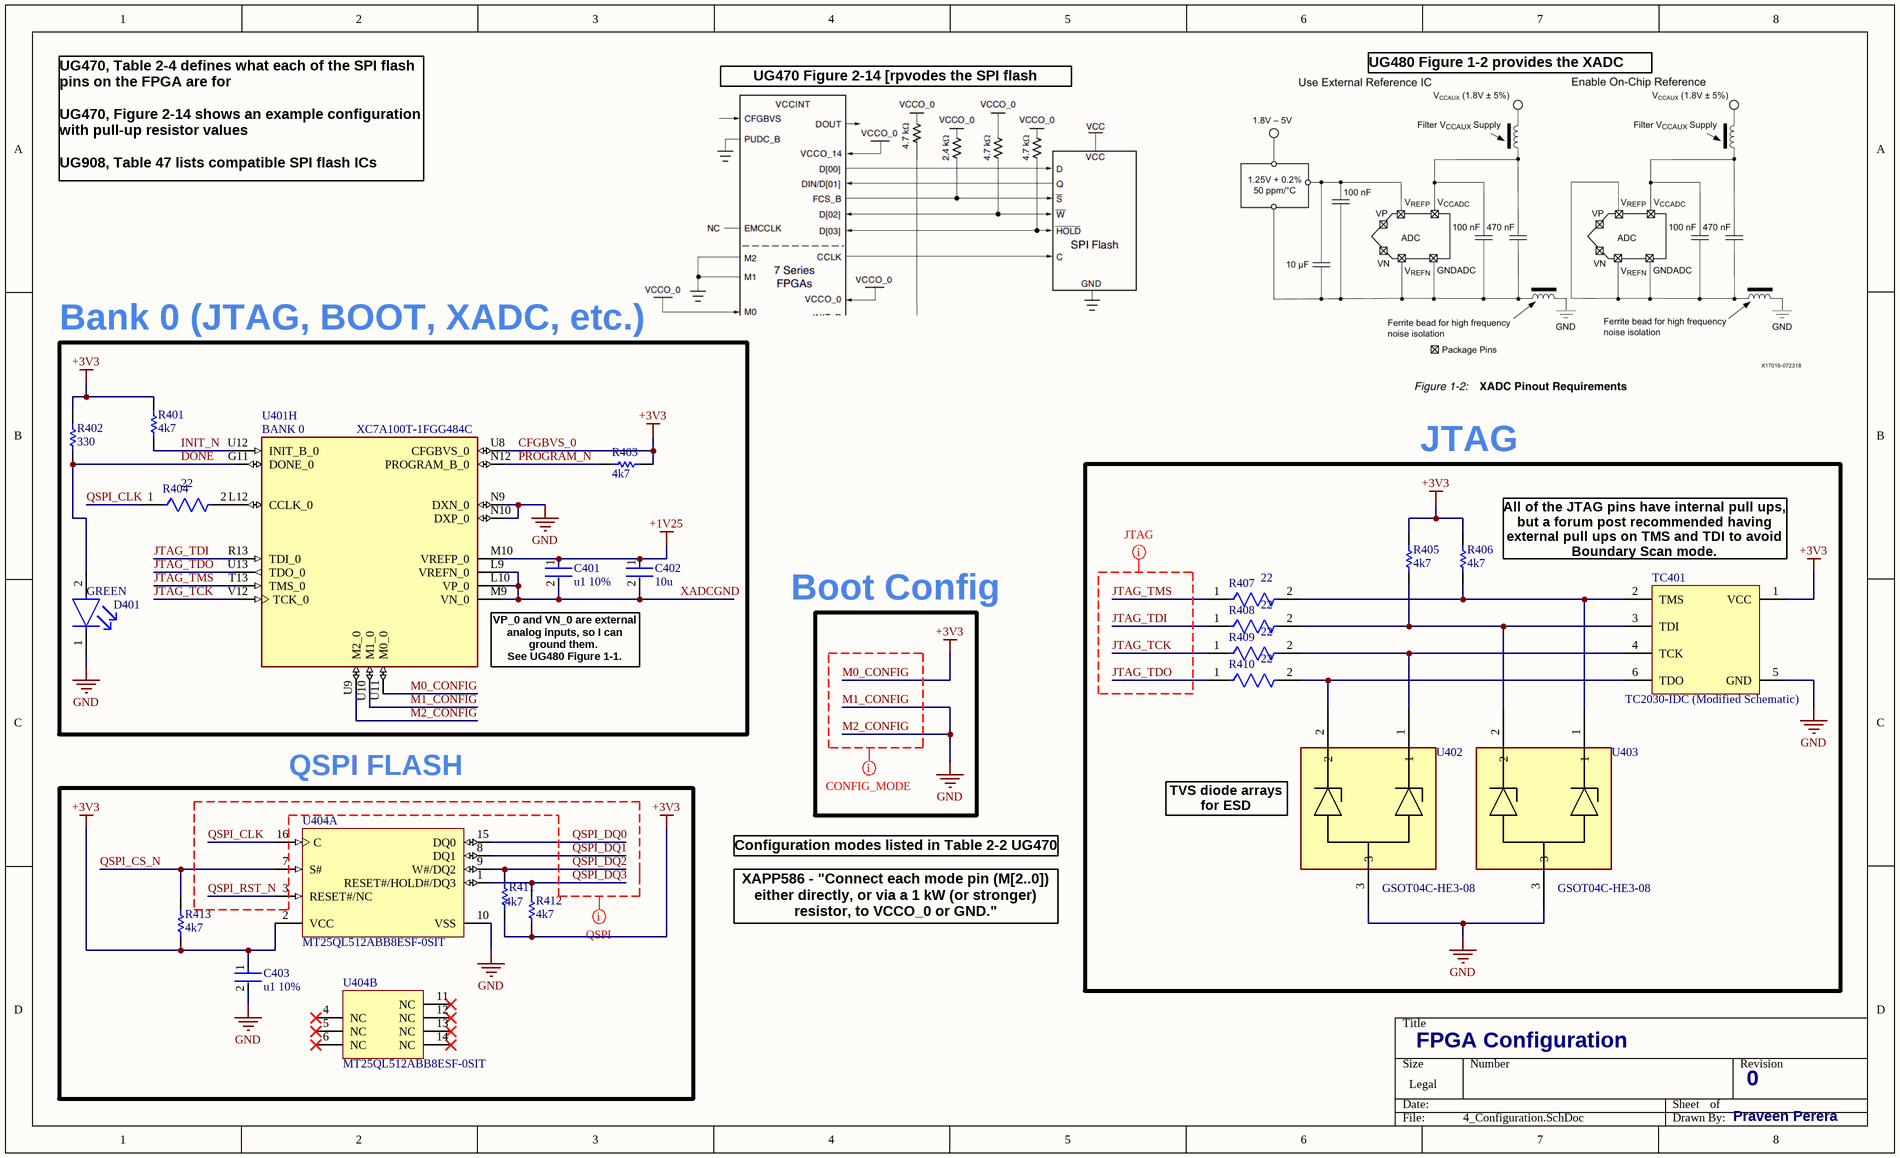
[diagram p3: 4_Configuration.SchDoc]

### Parts
C401  u1 10%  [FP-CL891-IPC_C]
C402  10u  [FP-CL05A106MP5NUNC-MFG]
C403  u1 10%  [FP-CL891-IPC_C]
D401  GREEN  [FP-SML-D12-MFG]
R401  4k7  [RESC0603X28X15NL05T05]
R402  330  [RESC0201(0603)_M]
R403  4k7  [RESC0603X28X15NL05T05]
R404  22  [FP-RMCF0201-IPC_C]
R405  4k7  [RESC0603X28X15NL05T05]
R406  4k7  [RESC0603X28X15NL05T05]
R407  22  [FP-RMCF0201-IPC_C]
R408  22  [FP-RMCF0201-IPC_C]
R409  22  [FP-RMCF0201-IPC_C]
R410  22  [FP-RMCF0201-IPC_C]
R411  4k7  [RESC0603X28X15NL05T05]
R412  4k7  [RESC0603X28X15NL05T05]
R413  4k7  [RESC0603X28X15NL05T05]
TC401  TC2030-IDC (Modified Schematic)  [*TC2030-IDC]
U401  XC7A100T-1FGG484C  [BGA484C100P22X22_2300X2300X260N]  (part H of 14)
U402  GSOT04C-HE3-08  [SOT_C-HE3-08_VIS]
U403  GSOT04C-HE3-08  [SOT_C-HE3-08_VIS]
U404  MT25QL512ABB8ESF-0SIT  [MICT-SF-16_L]  (parts A,B of 2)

### Nets
+1V25: C401.1 C402.1 U401.M10(VREFP_0)
+3V3: C403.1 R401.2 R402.1 R403.1 R405.2 R406.2 R411.1 R412.1 R413.1 TC401.1(VCC) U401.U8(CFGBVS_0) U401.U11(M0_0) U404.2(VCC)  [also labelled CFGBVS_0, M0_CONFIG]  [project net BUCK_1V_MODE]
GND: C403.2 D401.1(C) TC401.5(GND) U401.N9(DXN_0) U401.N10(DXP_0) U401.U9(M2_0) U401.U10(M1_0) U402.3 U403.3 U404.10(VSS)  [also labelled M1_CONFIG, M2_CONFIG]  [project net BUCK_1V_EPAD]
DONE: D401.2(A) R402.2 U401.G11(DONE_0)
INIT_N: R401.1 U401.U12(INIT_B_0)
JTAG_TCK: R409.1 U401.V12(TCK_0)
JTAG_TDI: R408.1 U401.R13(TDI_0)
JTAG_TDO: R410.1 U401.U13(TDO_0)
JTAG_TMS: R407.1 U401.T13(TMS_0)
PROGRAM_N: R403.2 U401.N12(PROGRAM_B_0)
QSPI_CLK: R404.1 U404.16(C)
QSPI_CS_N: R413.2 U404.7(S#)
QSPI_DQ0: U404.15(DQ0)
QSPI_DQ1: U404.8(DQ1)
QSPI_DQ2: R411.2 U404.9(W#/DQ2)
QSPI_DQ3: R412.2 U404.1(RESET#/HOLD#/DQ3)
QSPI_RST_N: U404.3(RESET#/NC)
XADCGND: C401.2 C402.2 U401.L9(VREFN_0) U401.L10(VP_0) U401.M9(VN_0)
NetR404_2: R404.2 U401.L12(CCLK_0)
NetR405_1: R405.1 R408.2 TC401.3(TDI) U403.2
NetR406_1: R406.1 R407.2 TC401.2(TMS) U403.1
NetR409_2: R409.2 TC401.4(TCK) U402.1
NetR410_2: R410.2 TC401.6(TDO) U402.2

Not connected (* = marked no-connect by the designer): U404 4(NC)* 5(NC)* 6(NC)* 11(NC)* 12(NC)* 13(NC)* 14(NC)*

### Layout directives
mark named QSPI: QSPI_CLK, QSPI_DQ0, QSPI_DQ1, QSPI_DQ2, QSPI_DQ3, QSPI_RST_N
mark named CONFIG_MODE: M0_CONFIG, M1_CONFIG, M2_CONFIG
mark named JTAG: JTAG_TCK, JTAG_TDI, JTAG_TDO, JTAG_TMS

### Notes on the sheet
- UG470 Figure 2-14 [rpvodes the SPI flash configuration
- UG480 Figure 1-2 provides the XADC pinout
- UG470, Table 2-4 defines what each of the SPI flash pins on the FPGA are for
  UG470, Figure 2-14 shows an example configuration with pull-up resistor values
  UG908, Table 47 lists compatible SPI flash ICs
- Bank 0 (JTAG, BOOT, XADC, etc.)
- JTAG
- All of the JTAG pins have internal pull ups, but a forum post recommended having external pull ups on TMS and TDI to avoid Boundary Scan mode.
- Boot Config
- (near U401) VP_0 and VN_0 are external analog inputs, so I can ground them.
  See UG480 Figure 1-1.
- QSPI FLASH
- (near U402) TVS diode arrays for ESD protection
- Configuration modes listed in Table 2-2 UG470
- XAPP586 - "Connect each mode pin (M[2..0]) either directly, or via a 1 kW (or stronger) resistor, to VCCO_0 or GND."
- (in symbol XC7A100T-1FGG484C, part H) BANK 0

### Library data of the parts
C401 C403 = CMP-13271-001945-1: as C303 on sheet 3_PowerDistribution
C402 = CMP-13271-000002-1: CL05A106MP5NUNC / CAP CER 10UF 10V X5R 0402; Manufacturer: Samsung; Temperature Coefficient: 15%; Tolerance: 20%; Material: Ceramic; Octopart: https://octopart.com/cl05a106mp5nunc-samsung-22457395; Voltage Rating: 10V; RoHS: TRUE; Value: 10uF; Height: 0.7mm; Digikey Description: CAP CER 10UF 10V X5R 0402; Automotive: No; Package: CL05A106MP5NUNC; Device Class L1: Passive Components; Capacitance: 10uF; Temperature Range High: +85°C; ComponentLink2Description: Datasheet; Device Class L2: Capacitors; Temperature Characteristic: X5R; Manufacturer Part Number: CL05A106MP5NUNC; Temperature: -55°C to +85°C; ComponentLink2URL: http://www.samsungsem.com/kr/support/product-search/mlcc/__icsFiles/afieldfile/2019/05/10/19-CL05A106MP5NUNC.pdf; Device Class L3: Ceramic Capacitors; Category: Cap; Temperature Range Low: -55°C; Ipc Land Pattern Name: CAPC10050X50; Lead Free: Yes
D401 = CMP-08952-000005-1: SML-D12M1WT86 / LED YLW/GREEN DIFFUSED 1608 SMD; Manufacturer: Rohm; Led Orientation: Top View; Forward Voltage: 2.2V; Power Dissipation: 54mW; Wavelength: 572nm; Reverse Voltage: 5V; Forward Current: 20mA; Luminous Intensity: 30mcd; Manufacturer Part Number: SML-D12M1WT86; RoHS: TRUE; Package: SML-D12; Temperature Range Low: -40°C; Device Class L3: unset; Temperature Range High: +85°C; Device Class L2: LEDs; Category: Diode; Device Class L1: Optoelectronics; Digikey Description: LED YLW/GREEN DIFFUSED 1608 SMD; Temperature: -40°C to +85°C; ComponentLink2Description: Datasheet; Colour: Green; Automotive: No; Height: 0.65mm; Lead Free: Yes; Octopart: https://octopart.com/sml-d12m1wt86-rohm-70837112; ComponentLink2URL: https://www.rohm.com/datasheet/SML-D12M1W
R401 R403 R405 R406 R411-R413 = CMP-2004-00672-1: CRCW02014K70FNED; Manufacturer: Vishay Dale; Part Number: CRCW02014K70FNED
R402 = CMP-1010-00062-1: 330R 0.05W 5% 0201 (0603 Metric)  SMD; Case-EIA: 0201; Value: 330.00 Ohm; Case-Metric: 0603; Tolerance: 5 %; Technology: SMT; Power: 0.05 W
R404 R407-R410 = CMP-26527-003623-1: RMCF0201JG22R0 / 22Ω ±5% 0.05W 0201 Thick Film Chip Resistor AEC-Q200 compliant; Max Power Dissipation: 50mW; Resistance: 22R; Temperature Coefficient: 200ppm/°C; Length: 0.024inch; Height: 0.009inch; Max Operating Temperature: 125°C; Packaging: Tape and Reel; Number of Terminations: 2; Case/Package: 0201; Resistor Type: Thick Film; Width: 0.012inch; Case Code (Metric): 0603; Min Operating Temperature: -55°C; Case Code (Imperial): 0201; Tolerance: 5%
TC401 = CMP-022-000000-2: PLUG-OF-NAILS 6-PIN W/ LEGS 8; MF: Tag-Connect LLC; MP: TC2030-IDC; Component Type: Standard; Source: TC2030-IDC Modified.SchLib; Pin Count: 6; Value: *; SnapEDA_Link: https://www.snapeda.com/parts/TC2030-IDC/Tag-Connect/view-part/?ref=snap; Package: None; Design Item ID: TC2030-IDC; Check_prices: https://www.snapeda.com/parts/TC2030-IDC/Tag-Connect/view-part/?ref=eda
U401 = XC7A100T-1FGG484C: as U301 on sheet 3_PowerDistribution; Value: *; Check_prices: https://www.snapeda.com/parts/XC7A100T-1FGG484C/Xilinx/view-part/?ref=eda; MP: XC7A100T-1FGG484C; SnapEDA_Link: https://www.snapeda.com/parts/XC7A100T-1FGG484C/Xilinx/view-part/?ref=snap; Package: FBGA-484 Xilinx
U402 U403 = GSOT04C-HE3-08: ESD PROTECTION DIODE SOT23; Manufacturer_Name: Vishay; Type: Type; Datasheet: https://www.vishay.com/doc?85824; Manufacturer_Part_Number: GSOT04C-HE3-08; Copyright: Copyright (C) 2025 Ultra Librarian. All rights reserved.; RefDes: RefDes
U404 = CMP-2000-07603-1: Micron Serial NOR Flash Memory, 512 Mbits, 2.7 to 3.6 V, -40 to 85 degC, 16-Pin SOP2 (SF), RoHS; Operating Supply Voltage: 3V; Min Supply Voltage: 2.7V; Page Size: 256B; Access Time: 6ns; Max Supply Voltage: 3.6V; Frequency: 133MHz; Density: 512Mb; Datasheet URL: https://www.micron.com/~/media/documents/products/data-sheet/nor-flash/serial-nor/mt25q/die-rev-b/mt25q_qlkt_l_512_abb_0.pdf; Mounting Technology: SurfaceMount; Min Operating Temperature: -40degC; Package Reference: SF-16; Mount: SurfaceMount; Package Description: 16-Pin Small Outline Integrated Circuit Wide, Body 7.5 X 10.3 mm, Pitch 1.27 mm; Interface: Serial; Memory Type: FLASH; Datasheet Version: Rev. E, 06/2017; Manufacturer URL: http://www.micron.com/; RoHSCompliant: True; Manufacturer: Micron; Max Operating Temperature: 85degC

## Sheet 5_GPIOBanks.SchDoc: GPIO Banks (13-16)
size Legal; Date: 12/27/2025; Author: Praveen Perera; DrawnBy: Praveen Perera; Engineer: Praveen Perera; Revision: 3; SheetNumber: 5; SheetTotal: 9
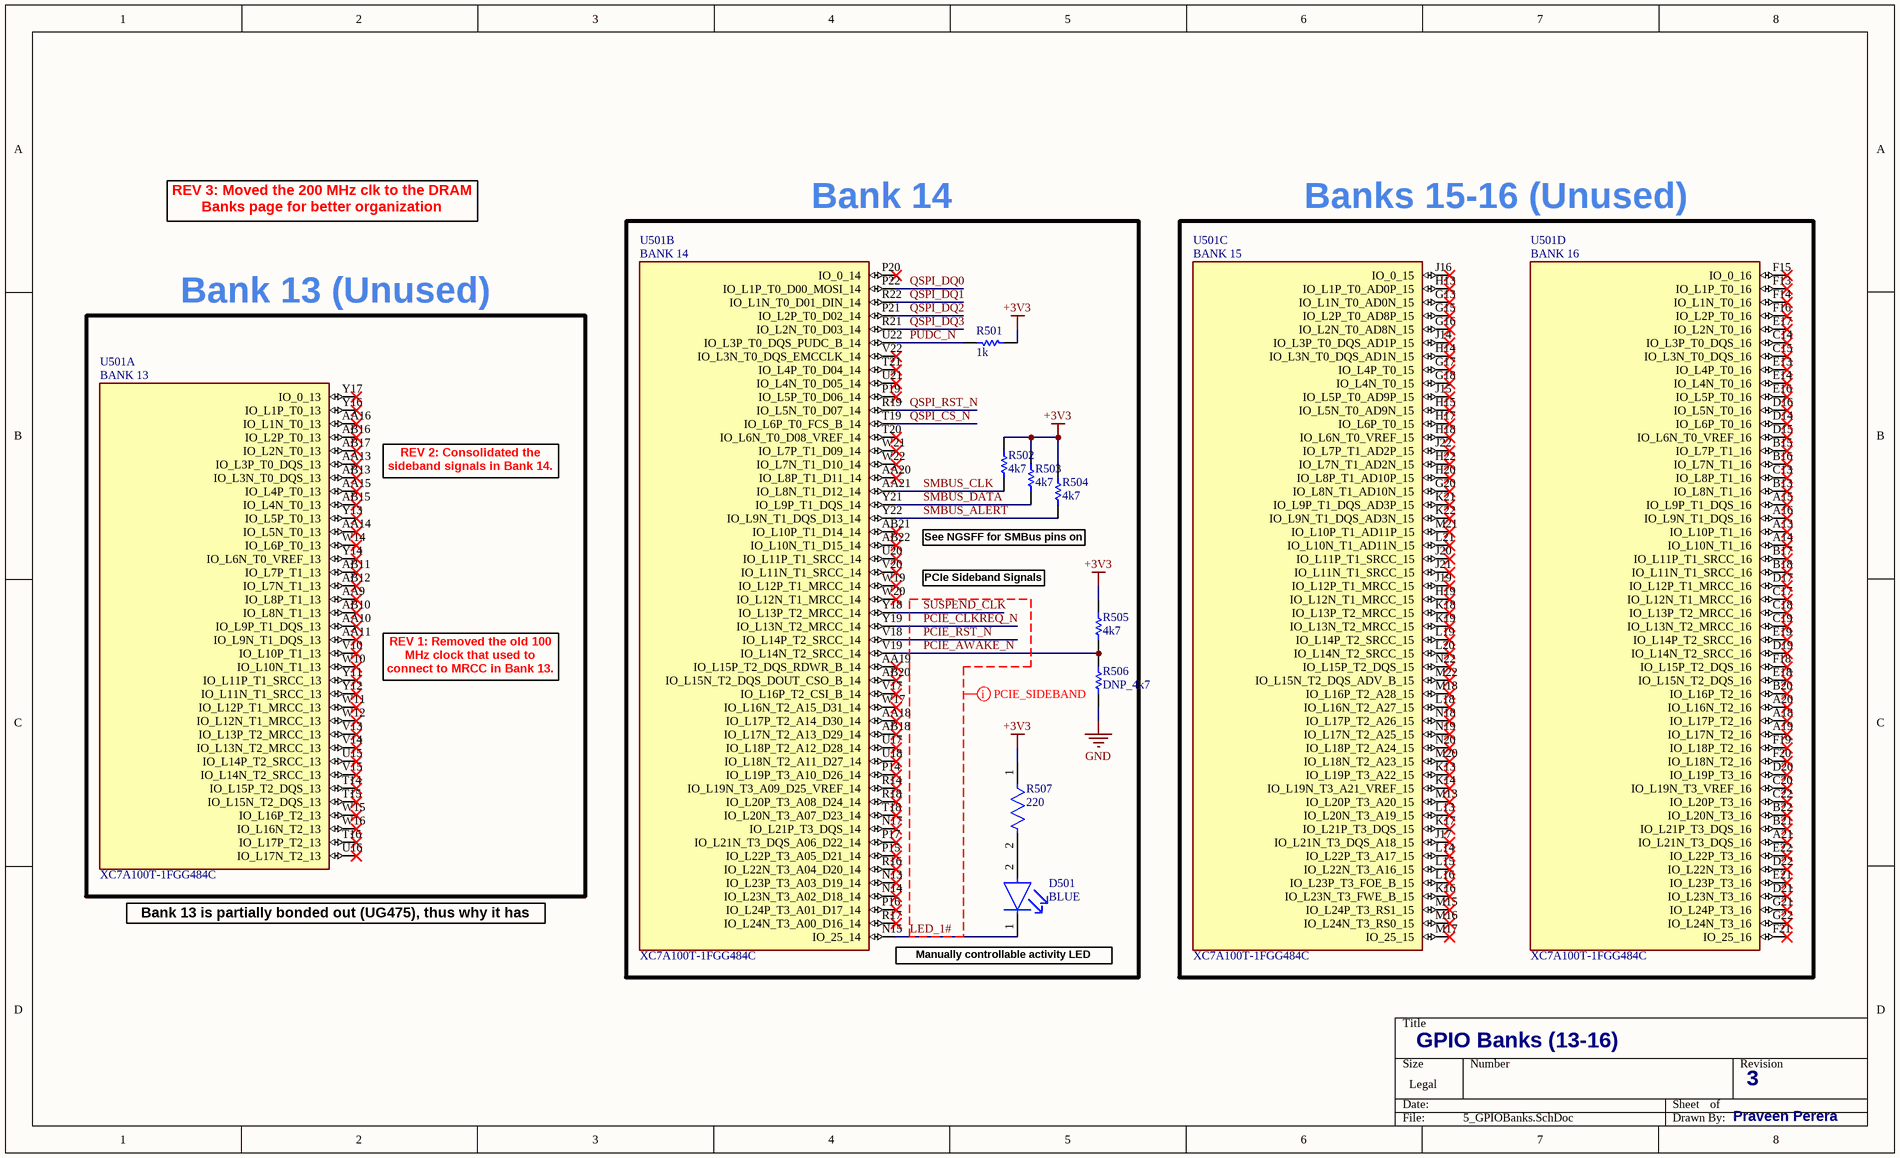
[diagram p4: 5_GPIOBanks.SchDoc]

### Parts
D501  BLUE  [FP-LTST-C193TBKT-5A-MFG]
R501  1k  [RESC0603X28X15ML05T05]
R502  4k7  [RESC0603X28X15NL05T05]
R503  4k7  [RESC0603X28X15NL05T05]
R504  4k7  [RESC0603X28X15NL05T05]
R505  4k7  [RESC0603X28X15NL05T05]
R506  DNP_4k7  [RESC0603X28X15NL05T05]
R507  220  [FP-CR0402-IPC_B]
U501  XC7A100T-1FGG484C  [BGA484C100P22X22_2300X2300X260N]  (parts A,B,C,D of 14)

### Nets
+3V3: R501.1 R502.2 R503.2 R504.2 R505.2 R507.1  [project net BUCK_1V_MODE]
GND: R506.1  [project net BUCK_1V_EPAD]
LED_1#: D501.1(C) U501.N15(IO_25_14)
PCIE_AWAKE_N: R505.1 R506.2 U501.V19(IO_L14N_T2_SRCC_14)
PCIE_CLKREQ_N: U501.Y19(IO_L13N_T2_MRCC_14)
PCIE_RST_N: U501.V18(IO_L14P_T2_SRCC_14)
PUDC_N: R501.2 U501.U22(IO_L3P_T0_DQS_PUDC_B_14)
QSPI_CS_N: U501.T19(IO_L6P_T0_FCS_B_14)
QSPI_DQ0: U501.P22(IO_L1P_T0_D00_MOSI_14)
QSPI_DQ1: U501.R22(IO_L1N_T0_D01_DIN_14)
QSPI_DQ2: U501.P21(IO_L2P_T0_D02_14)
QSPI_DQ3: U501.R21(IO_L2N_T0_D03_14)
QSPI_RST_N: U501.R19(IO_L5N_T0_D07_14)
SMBUS_ALERT: R504.1 U501.Y22(IO_L9N_T1_DQS_D13_14)
SMBUS_CLK: R502.1 U501.AA21(IO_L8N_T1_D12_14)
SMBUS_DATA: R503.1 U501.Y21(IO_L9P_T1_DQS_14)
SUSPEND_CLK: U501.Y18(IO_L13P_T2_MRCC_14)
NetD501_2: D501.2(A) R507.2

Not connected (* = marked no-connect by the designer): U501 A13(IO_L10P_T1_16)* A14(IO_L10N_T1_16)* A15(IO_L9P_T1_DQS_16)* A16(IO_L9N_T1_DQS_16)* A18(IO_L17P_T2_16)* A19(IO_L17N_T2_16)* A20(IO_L16N_T2_16)* A21(IO_L21N_T3_DQS_16)* AA9(IO_L8P_T1_13)* AA10(IO_L9P_T1_DQS_13)* AA11(IO_L9N_T1_DQS_13)* AA13(IO_L3P_T0_DQS_13)* AA14(IO_L5N_T0_13)* AA15(IO_L4P_T0_13)* AA16(IO_L1N_T0_13)* AA18(IO_L17P_T2_A14_D30_14)* AA19(IO_L15P_T2_DQS_RDWR_B_14)* AA20(IO_L8P_T1_D11_14)* AB10(IO_L8N_T1_13)* AB11(IO_L7P_T1_13)* AB12(IO_L7N_T1_13)* AB13(IO_L3N_T0_DQS_13)* AB15(IO_L4N_T0_13)* AB16(IO_L2P_T0_13)* AB17(IO_L2N_T0_13)* AB18(IO_L17N_T2_A13_D29_14)* AB20(IO_L15N_T2_DQS_DOUT_CSO_B_14)* AB21(IO_L10P_T1_D14_14)* AB22(IO_L10N_T1_D15_14)* B13(IO_L8N_T1_16)* B15(IO_L7P_T1_16)* B16(IO_L7N_T1_16)* B17(IO_L11P_T1_SRCC_16)* B18(IO_L11N_T1_SRCC_16)* B20(IO_L16P_T2_16)* B21(IO_L21P_T3_DQS_16)* B22(IO_L20N_T3_16)* C13(IO_L8P_T1_16)* C14(IO_L3P_T0_DQS_16)* C15(IO_L3N_T0_DQS_16)* C17(IO_L12N_T1_MRCC_16)* C18(IO_L13P_T2_MRCC_16)* C19(IO_L13N_T2_MRCC_16)* C20(IO_L19N_T3_VREF_16)* C22(IO_L20P_T3_16)* D14(IO_L6P_T0_16)* D15(IO_L6N_T0_VREF_16)* D16(IO_L5N_T0_16)* D17(IO_L12P_T1_MRCC_16)* D19(IO_L14N_T2_SRCC_16)* D20(IO_L19P_T3_16)* D21(IO_L23N_T3_16)* D22(IO_L22N_T3_16)* E13(IO_L4P_T0_16)* E14(IO_L4N_T0_16)* E16(IO_L5P_T0_16)* E17(IO_L2N_T0_16)* E18(IO_L15N_T2_DQS_16)* E19(IO_L14P_T2_SRCC_16)* E21(IO_L23P_T3_16)* E22(IO_L22P_T3_16)* F13(IO_L1P_T0_16)* F14(IO_L1N_T0_16)* F15(IO_0_16)* F16(IO_L2P_T0_16)* F18(IO_L15P_T2_DQS_16)* F19(IO_L18P_T2_16)* F20(IO_L18N_T2_16)* F21(IO_25_16)* G13(IO_L1N_T0_AD0N_15)* G15(IO_L2P_T0_AD8P_15)* G16(IO_L2N_T0_AD8N_15)* G17(IO_L4P_T0_15)* G18(IO_L4N_T0_15)* G20(IO_L8N_T1_AD10N_15)* G21(IO_L24P_T3_16)* G22(IO_L24N_T3_16)* H13(IO_L1P_T0_AD0P_15)* H14(IO_L3N_T0_DQS_AD1N_15)* H15(IO_L5N_T0_AD9N_15)* H17(IO_L6P_T0_15)* H18(IO_L6N_T0_VREF_15)* H19(IO_L12N_T1_MRCC_15)* H20(IO_L8P_T1_AD10P_15)* H22(IO_L7N_T1_AD2N_15)* J14(IO_L3P_T0_DQS_AD1P_15)* J15(IO_L5P_T0_AD9P_15)* J16(IO_0_15)* J17(IO_L21N_T3_DQS_A18_15)* J19(IO_L12P_T1_MRCC_15)* J20(IO_L11P_T1_SRCC_15)* J21(IO_L11N_T1_SRCC_15)* J22(IO_L7P_T1_AD2P_15)* K13(IO_L19P_T3_A22_15)* K14(IO_L19N_T3_A21_VREF_15)* K16(IO_L23N_T3_FWE_B_15)* K17(IO_L21P_T3_DQS_15)* K18(IO_L13P_T2_MRCC_15)* K19(IO_L13N_T2_MRCC_15)* K21(IO_L9P_T1_DQS_AD3P_15)* K22(IO_L9N_T1_DQS_AD3N_15)* L13(IO_L20N_T3_A19_15)* L14(IO_L22P_T3_A17_15)* L15(IO_L22N_T3_A16_15)* L16(IO_L23P_T3_FOE_B_15)* L18(IO_L16N_T2_A27_15)* L19(IO_L14P_T2_SRCC_15)* L20(IO_L14N_T2_SRCC_15)* L21(IO_L10N_T1_AD11N_15)* M13(IO_L20P_T3_A20_15)* M15(IO_L24P_T3_RS1_15)* M16(IO_L24N_T3_RS0_15)* M17(IO_25_15)* M18(IO_L16P_T2_A28_15)* M20(IO_L18N_T2_A23_15)* M21(IO_L10P_T1_AD11P_15)* M22(IO_L15N_T2_DQS_ADV_B_15)* N13(IO_L23P_T3_A03_D19_14)* N14(IO_L23N_T3_A02_D18_14)* N17(IO_L21P_T3_DQS_14)* N18(IO_L17P_T2_A26_15)* N19(IO_L17N_T2_A25_15)* N20(IO_L18P_T2_A24_15)* N22(IO_L15P_T2_DQS_15)* P14(IO_L19P_T3_A10_D26_14)* P15(IO_L22P_T3_A05_D21_14)* P16(IO_L24P_T3_A01_D17_14)* P17(IO_L21N_T3_DQS_A06_D22_14)* P19(IO_L5P_T0_D06_14)* P20(IO_0_14)* R14(IO_L19N_T3_A09_D25_VREF_14)* R16(IO_L22N_T3_A04_D20_14)* R17(IO_L24N_T3_A00_D16_14)* R18(IO_L20P_T3_A08_D24_14)* T14(IO_L15P_T2_DQS_13)* T15(IO_L15N_T2_DQS_13)* T16(IO_L17P_T2_13)* T18(IO_L20N_T3_A07_D23_14)* T20(IO_L6N_T0_D08_VREF_14)* T21(IO_L4P_T0_D04_14)* U15(IO_L14P_T2_SRCC_13)* U16(IO_L17N_T2_13)* U17(IO_L18P_T2_A12_D28_14)* U18(IO_L18N_T2_A11_D27_14)* U20(IO_L11P_T1_SRCC_14)* U21(IO_L4N_T0_D05_14)* V10(IO_L10P_T1_13)* V13(IO_L13P_T2_MRCC_13)* V14(IO_L13N_T2_MRCC_13)* V15(IO_L14N_T2_SRCC_13)* V17(IO_L16P_T2_CSI_B_14)* V20(IO_L11N_T1_SRCC_14)* V22(IO_L3N_T0_DQS_EMCCLK_14)* W10(IO_L10N_T1_13)* W11(IO_L12P_T1_MRCC_13)* W12(IO_L12N_T1_MRCC_13)* W14(IO_L6P_T0_13)* W15(IO_L16P_T2_13)* W16(IO_L16N_T2_13)* W17(IO_L16N_T2_A15_D31_14)* W19(IO_L12P_T1_MRCC_14)* W20(IO_L12N_T1_MRCC_14)* W21(IO_L7P_T1_D09_14)* W22(IO_L7N_T1_D10_14)* Y11(IO_L11P_T1_SRCC_13)* Y12(IO_L11N_T1_SRCC_13)* Y13(IO_L5P_T0_13)* Y14(IO_L6N_T0_VREF_13)* Y16(IO_L1P_T0_13)* Y17(IO_0_13)*

### Layout directives
mark named PCIE_SIDEBAND: LED_1#, PCIE_AWAKE_N, PCIE_CLKREQ_N, PCIE_RST_N, SUSPEND_CLK

### Notes on the sheet
- REV 3: Moved the 200 MHz clk to the DRAM Banks page for better organization
- Bank 14
- Banks 15-16 (Unused)
- Bank 13 (Unused)
- REV 2: Consolidated the sideband signals in Bank 14.
- See NGSFF for SMBus pins on M.2
- PCIe Sideband Signals
- REV 1: Removed the old 100 MHz clock that used to connect to MRCC in Bank 13.
- (near U501) Bank 13 is partially bonded out (UG475), thus why it has less pins
- Manually controllable activity LED
- (in symbol XC7A100T-1FGG484C, part A) BANK 13
- (in symbol XC7A100T-1FGG484C, part B) BANK 14
- (in symbol XC7A100T-1FGG484C, part C) BANK 15
- (in symbol XC7A100T-1FGG484C, part D) BANK 16

### Library data of the parts
D501 = CMP-2000-06624-2: LTST-C193TBKT-5A / LED BLUE CLEAR CHIP SMD; Number of Elements: 1; Forward Voltage: 2.8V; Forward Current: 20mA; Test Current: 5mA; Lens Color: Colorless; Dominant Wavelength: 475nm; Reverse Voltage: 5V; Viewing Angle: 130°; Lens Style: Diffused; Luminous Intensity: 15mcd; Power Dissipation: 76mW; Max Operating Temperature: 80°C; Length: 1.6mm; Number of LEDs: 1; Case/Package: 0603; Case Code (Metric): 1608; Number of Pins: 2; Radiation Hardening: No; Min Operating Temperature: -20°C; Width: 0.8mm; Packaging: Tape and Reel; Package Quantity: 1; Lead Free: Lead Free; Lens Transparency: Clear; Illumination Color: Blue; Color: Blue; RoHS Compliant: Yes; Mount: Surface Mount; Depth: 0.8mm; Case Code (Imperial): 0603; Height: 0.35mm
R501 = CMP-1010-00074-2: CRCW02011K00JNED; Manufacturer: Vishay Dale; Part Number: CRCW02011K00JNED
R502-R506 = CMP-2004-00672-1: as R401 on sheet 4_Configuration; Part Number: CRCW02014K70FNED
R507 = CMP-2002-04925-2: CR0402-FX-2200GLF / Thick Film Chip Resistors 0402 220Ω 0.0625W 1% 100ppm/°C; Voltage Rating: 50V; Power Rating: 62.5mW; Resistance: 220R; Packaging: Tape and Reel; Mount: Surface Mount; Military Standard: Not; Case Code (Metric): 1005; Package Quantity: 10000; Thickness: 356um; Tolerance: 1%; Max Operating Temperature: 125°C; Temperature Coefficient: 100ppm/°C; Case Code (Imperial): 0402; Contact Plating: Tin; Width: 0.5mm; Length: 1mm; Height: 0.35mm; Termination: SMD/SMT; Composition: Thick Film; Min Operating Temperature: -55°C; Case/Package: 0402; Radiation Hardening: No; Depth: 0.5mm
U501 = XC7A100T-1FGG484C: as U301 on sheet 3_PowerDistribution; Value: *; Check_prices: https://www.snapeda.com/parts/XC7A100T-1FGG484C/Xilinx/view-part/?ref=eda; MP: XC7A100T-1FGG484C; SnapEDA_Link: https://www.snapeda.com/parts/XC7A100T-1FGG484C/Xilinx/view-part/?ref=snap; Package: FBGA-484 Xilinx